# Altium project SLT_110.PrjPcb (part 2 of 3)

## Sheet CAN_I2C.SchDoc
size 420 x 297 mm; SheetNumber: 11; SheetTotal: 20
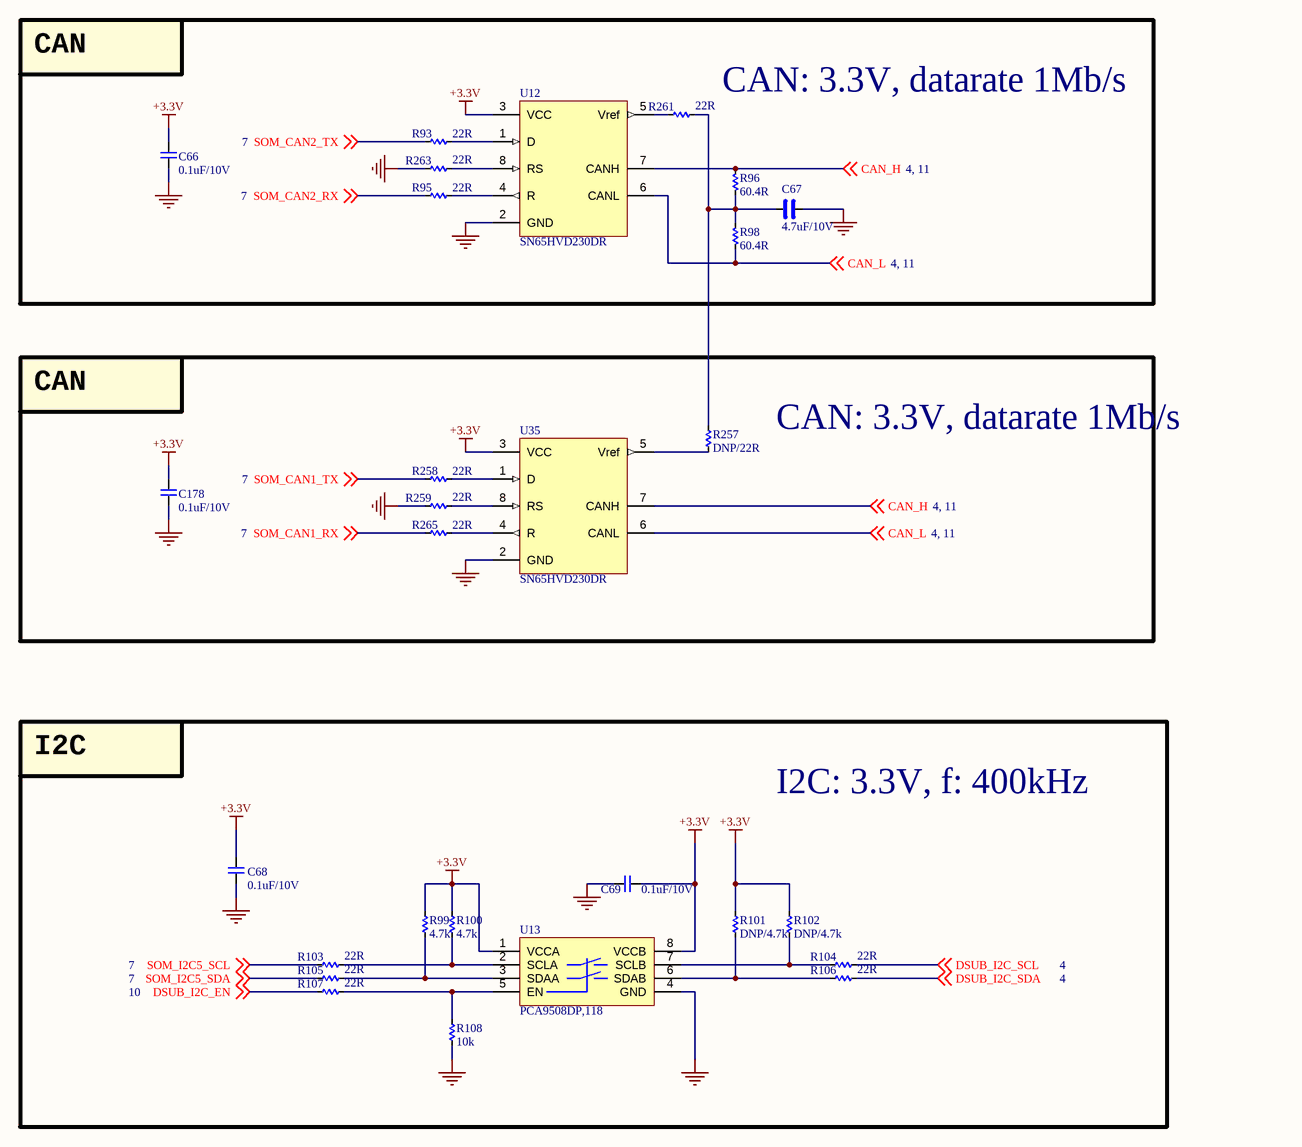
[diagram p9: CAN_I2C.SchDoc]

### Parts
C66  0.1uF/10V  [CAP_C_1005X60]
C67  4.7uF/10V  [CAP_C_1608X80]
C68  0.1uF/10V  [CAP_C_1005X60]
C69  0.1uF/10V  [CAP_C_1005X60]
C178  0.1uF/10V  [CAP_C_1005X60]
R93  22R  [RES_C_1005X40]
R95  22R  [RES_C_1005X40]
R96  60.4R  [RES_C_1005X40]
R98  60.4R  [RES_C_1005X40]
R99  4.7k  [RES_C_1005X40]
R100  4.7k  [RES_C_1005X40]
R101  DNP/4.7k  [RES_C_1005X40]
R102  DNP/4.7k  [RES_C_1005X40]
R103  22R  [RES_C_1005X40]
R104  22R  [RES_C_1005X40]
R105  22R  [RES_C_1005X40]
R106  22R  [RES_C_1005X40]
R107  22R  [RES_C_1005X40]
R108  10k  [RES_C_1005X40]
R257  DNP/22R  [RES_C_1005X40]
R258  22R  [RES_C_1005X40]
R259  22R  [RES_C_1005X40]
R261  22R  [RES_C_1005X40]
R263  22R  [RES_C_1005X40]
R265  22R  [RES_C_1005X40]
U12  SN65HVD230DR  [SOIC127P602X173-8N]
U13  PCA9508DP,118  [TSOP8]
U35  SN65HVD230DR  [SOIC127P602X173-8N]

### Blocks framed on the sheet
CAN: 3.3V, datarate 1Mb/s: C66 C67 R93 R95 R96 R98 R261 R263 U12
CAN: 3.3V, datarate 1Mb/s: C178 R257-R259 R265 U35
I2C: 3.3V, f: 400kHz: C68 C69 R99-R108 U13

### Nets
+3.3V: C66.2 C68.2 C69.1 C178.2 R99.1 R100.1 R101.1 R102.1 U12.3(VCC) U13.1(VCCA) U13.8(VCCB) U35.3(VCC)
GND: C66.1 C67.1 C68.1 C69.2 C178.1 R108.1 R259.2 R263.2 U12.2(GND) U13.4(GND) U35.2(GND)
CAN_H: R96.2 U12.7(CANH) U35.7(CANH) ; off-sheet CAN_H
CAN_L: R98.1 U12.6(CANL) U35.6(CANL) ; off-sheet CAN_L
DSUB_I2C_EN: R107.2 ; off-sheet DSUB_I2C_EN
DSUB_I2C_SCL: R104.1 ; off-sheet DSUB_I2C_SCL
DSUB_I2C_SDA: R106.1 ; off-sheet DSUB_I2C_SDA
SOM_CAN1_RX: R265.1 ; off-sheet SOM_CAN1_RX
SOM_CAN1_TX: R258.1 ; off-sheet SOM_CAN1_TX
SOM_CAN2_RX: R95.1 ; off-sheet SOM_CAN2_RX
SOM_CAN2_TX: R93.1 ; off-sheet SOM_CAN2_TX
SOM_I2C5_SCL: R103.2 ; off-sheet SOM_I2C5_SCL
SOM_I2C5_SDA: R105.2 ; off-sheet SOM_I2C5_SDA
NetC67_2: C67.2 R96.1 R98.2 R257.1 R261.1
NetR93_2: R93.2 U12.1(D)
NetR95_2: R95.2 U12.4(R)
NetR99_2: R99.2 R105.1 U13.3(SDAA)
NetR100_2: R100.2 R103.1 U13.2(SCLA)
NetR101_2: R101.2 R106.2 U13.6(SDAB)
NetR102_2: R102.2 R104.2 U13.7(SCLB)
NetR107_1: R107.1 R108.2 U13.5(EN)
NetR257_2: R257.2 U35.5(Vref)
NetR258_2: R258.2 U35.1(D)
NetR259_1: R259.1 U35.8(RS)
NetR261_2: R261.2 U12.5(Vref)
NetR263_1: R263.1 U12.8(RS)
NetR265_2: R265.2 U35.4(R)

### Notes on the sheet
- CAN
- I2C
- Project:
- Sub-system:
- Design by:
- Sheet title:
- Sheet
- of
- Checked by:
- Approved by:
- Revision:
- Document No:
- Size:
- Date:
- A3

### Library data of the parts
C66 C68 C69 C178 = _CAP_C_2: CAP CHIP
C67 = _CAP_C_High_2: CAP CHIP High Value
R93 R95 R96 R98-R108 R257-R259 R261 R263 R265 = _RES_B_2: RES
U12 U35 = IC_CAN_SN65HVD230DR: IC TRANSCEIVER HALF 1/1 8SOIC

## Sheet USB.SchDoc
size 420 x 297 mm; SheetNumber: 12; SheetTotal: 21
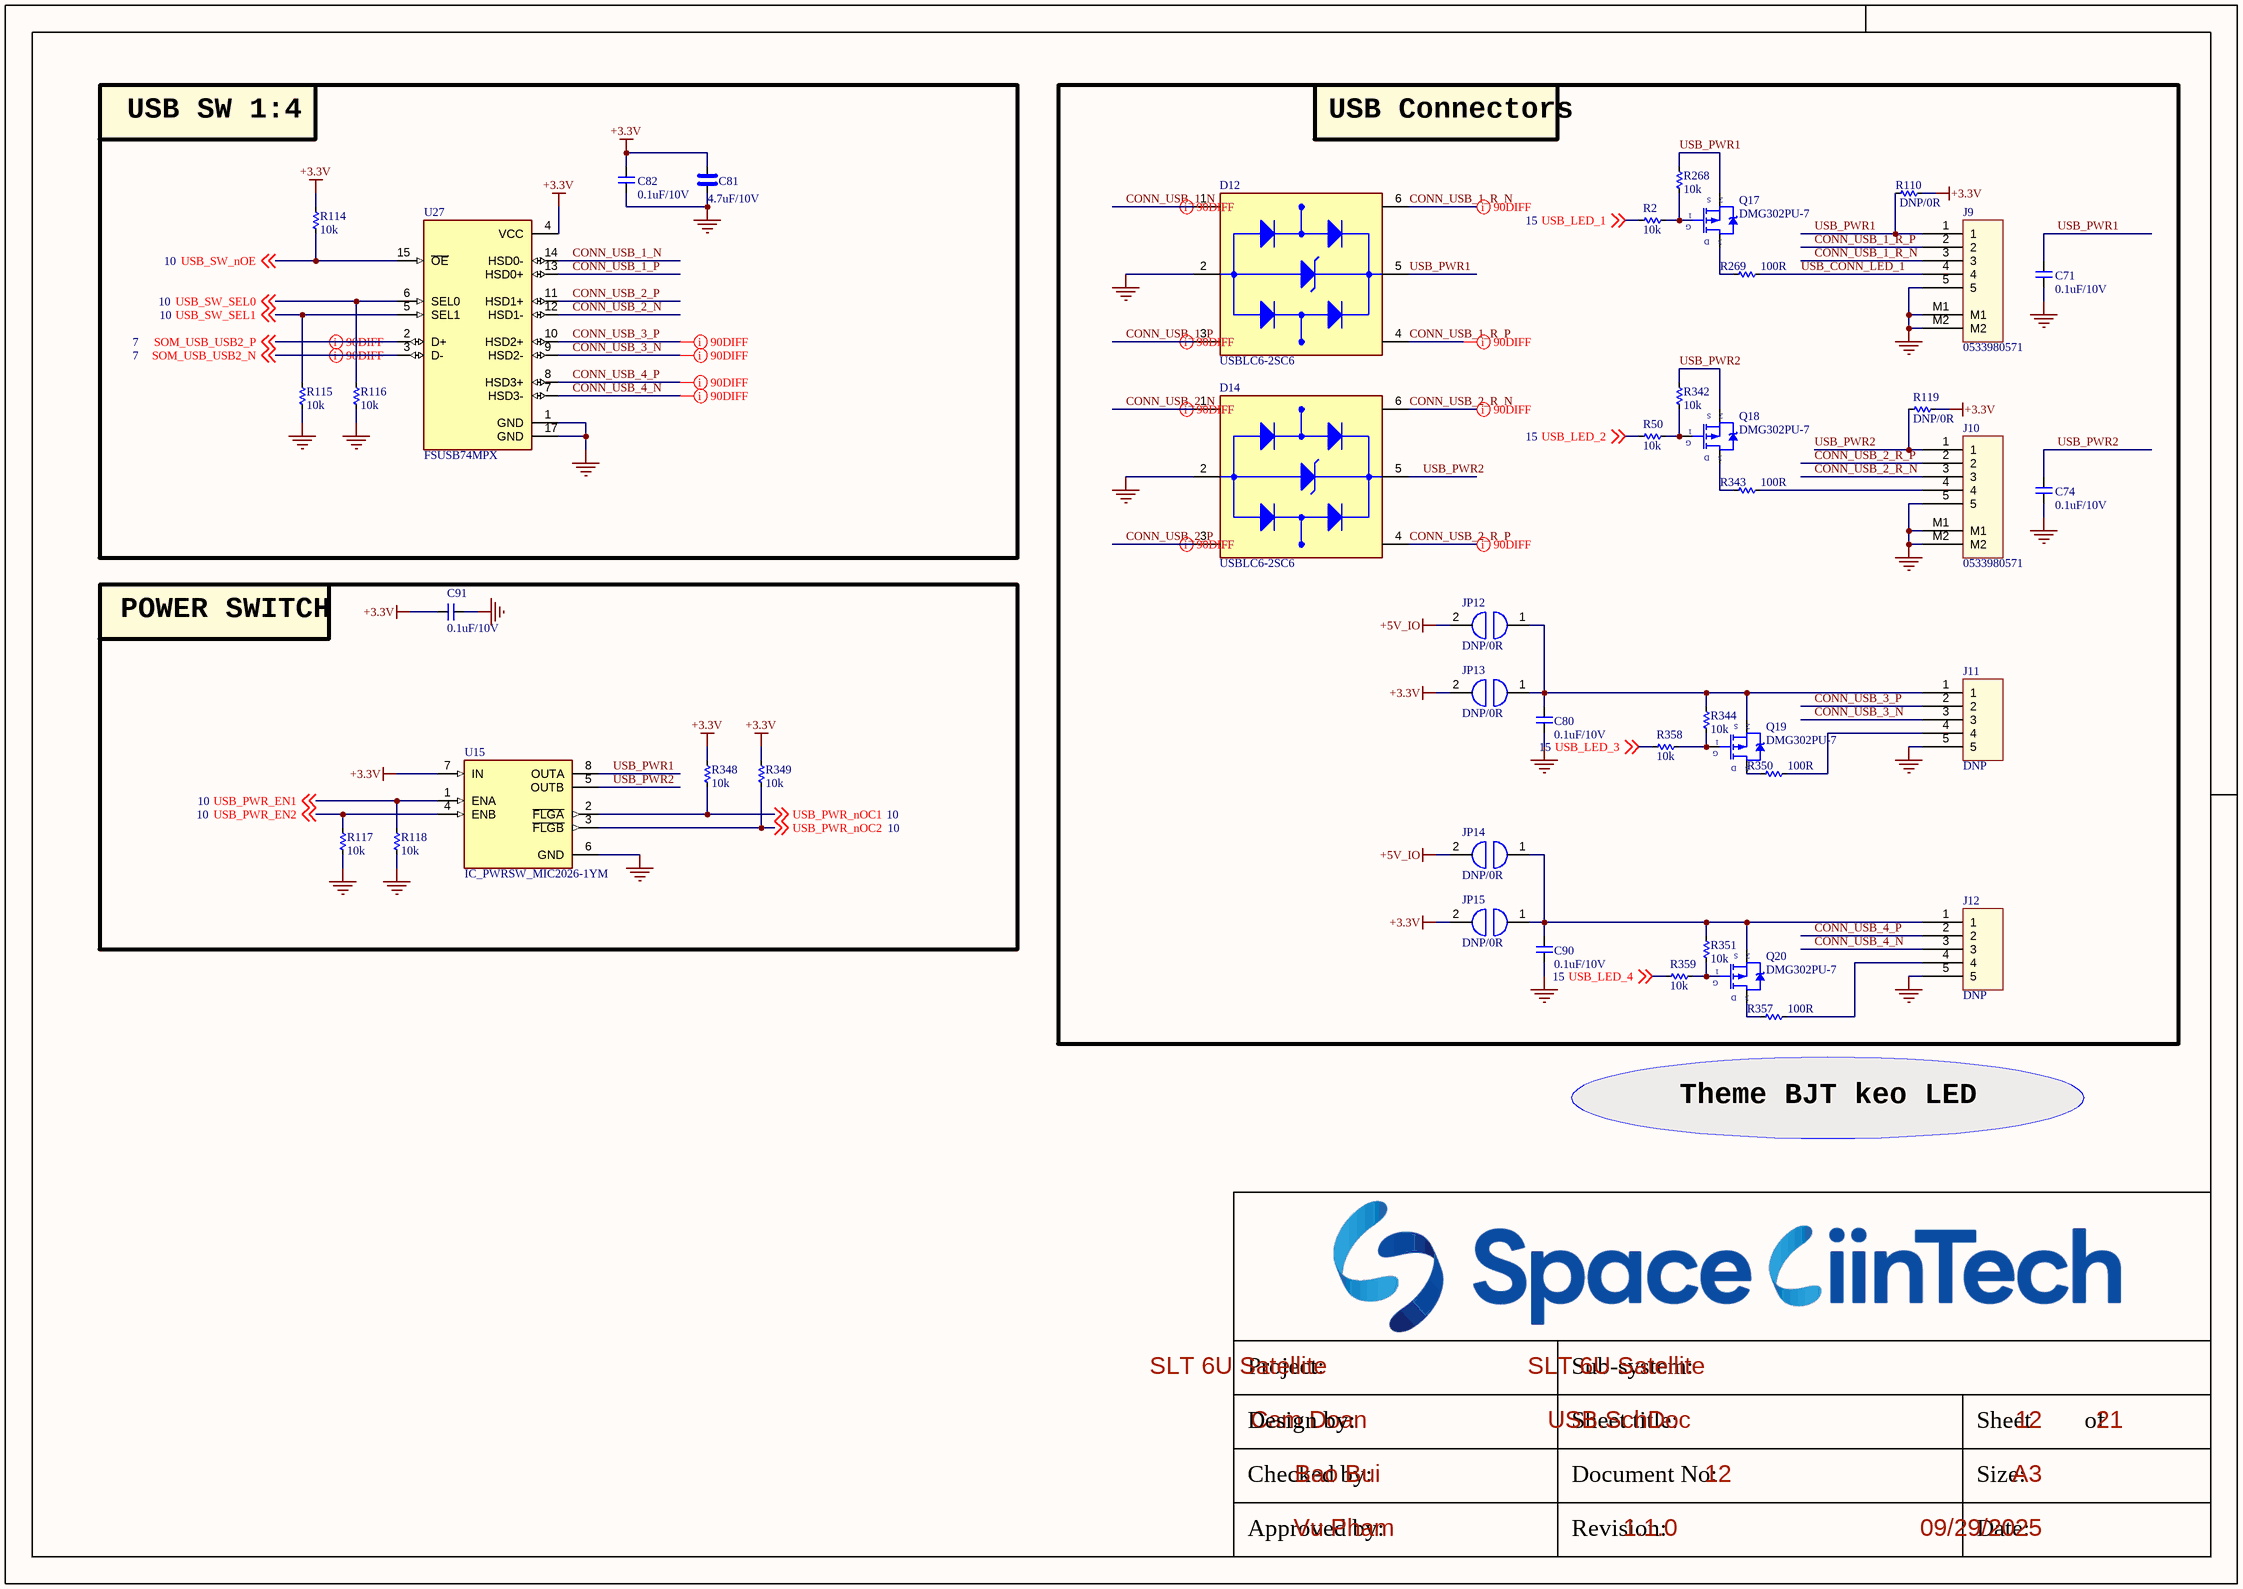
[diagram p10: USB.SchDoc]

### Parts
C71  0.1uF/10V  [CAP_C_1005X60]
C74  0.1uF/10V  [CAP_C_1005X60]
C80  0.1uF/10V  [CAP_C_1005X60]
C81  4.7uF/10V  [CAP_C_1608X80]
C82  0.1uF/10V  [CAP_C_1005X60]
C90  0.1uF/10V  [CAP_C_1005X60]
C91  0.1uF/10V  [CAP_C_1005X60]
D12  USBLC6-2SC6  [SOT95P280X145-6N]
D14  USBLC6-2SC6  [SOT95P280X145-6N]
J9  0533980571  [MOLEX_0533980571]
J10  0533980571  [MOLEX_0533980571]
J11  DNP  [SMD_5_PIN]
J12  DNP  [SMD_5_PIN]
JP12  DNP/0R  [RES_C_1608X60]
JP13  DNP/0R  [RES_C_1608X60]
JP14  DNP/0R  [RES_C_1608X60]
JP15  DNP/0R  [RES_C_1608X60]
Q17  DMG302PU-7  [SOT95P240X120-3N]
Q18  DMG302PU-7  [SOT95P240X120-3N]
Q19  DMG302PU-7  [SOT95P240X120-3N]
Q20  DMG302PU-7  [SOT95P240X120-3N]
R2  10k  [RES_C_1005X40]
R50  10k  [RES_C_1005X40]
R110  DNP/0R  [RES_C_1005X40]
R114  10k  [RES_C_1005X40]
R115  10k  [RES_C_1005X40]
R116  10k  [RES_C_1005X40]
R117  10k  [RES_C_1005X40]
R118  10k  [RES_C_1005X40]
R119  DNP/0R  [RES_C_1005X40]
R268  10k  [RES_C_1005X40]
R269  100R  [RES_C_1005X40]
R342  10k  [RES_C_1005X40]
R343  100R  [RES_C_1005X40]
R344  10k  [RES_C_1005X40]
R348  10k  [RES_C_1005X40]
R349  10k  [RES_C_1005X40]
R350  100R  [RES_C_1005X40]
R351  10k  [RES_C_1005X40]
R357  100R  [RES_C_1005X40]
R358  10k  [RES_C_1005X40]
R359  10k  [RES_C_1005X40]
U15  IC_PWRSW_MIC2026-1YM  [SOIC127P602X173-8N]
U27  FSUSB74MPX  [QFN50P300X300X80-17N]

### Blocks framed on the sheet
USB SW 1:4: C81 C82 R114-R116 U27
USB Connectors: C71 C74 C80 C90 D12 D14 J9-J12 JP12-JP15 Q17-Q20 R2 R50 R110 R119 R268 R269 R342-R344 R350 R351 R357-R359
POWER SWITCH: C91 R117 R118 R348 R349 U15

### Nets
+3.3V: C81.2 C82.2 C91.2 JP13.2 JP15.2 R110.1 R114.1 R119.1 R348.1 R349.1 U15.7(IN) U27.4(VCC)
+5V_IO: JP12.2 JP14.2  [project net NTC1+]
GND: C71.1 C74.1 C80.1 C81.1 C82.1 C90.1 C91.1 D12.2(GND) D14.2(GND) J9.5 J9.M1 J9.M2 J10.5 J10.M1 J10.M2 J11.5 J12.5 R115.2 R116.2 R117.2 R118.2 U15.6(GND) U27.1(GND) U27.17(GND)
CONN_USB_1_N: D12.1(I/O1_IN) U27.14(HSD0-)
CONN_USB_1_P: D12.3(I/O2_IN) U27.13(HSD0+)
CONN_USB_1_R_N: D12.6(I/O1_OUT) J9.3
CONN_USB_1_R_P: D12.4(I/O2_OUT) J9.2
CONN_USB_2_N: D14.1(I/O1_IN) U27.12(HSD1-)
CONN_USB_2_P: D14.3(I/O2_IN) U27.11(HSD1+)
CONN_USB_2_R_N: D14.6(I/O1_OUT) J10.3
CONN_USB_2_R_P: D14.4(I/O2_OUT) J10.2
CONN_USB_3_N: J11.3 U27.9(HSD2-)
CONN_USB_3_P: J11.2 U27.10(HSD2+)
CONN_USB_4_N: J12.3 U27.7(HSD3-)
CONN_USB_4_P: J12.2 U27.8(HSD3+)
SOM_USB_USB2_N: U27.3(D-) ; off-sheet SOM_USB_USB2_N
SOM_USB_USB2_P: U27.2(D+) ; off-sheet SOM_USB_USB2_P
USB_CONN_LED_1: J9.4 R269.2
USB_LED_1: R2.1 ; off-sheet USB_LED_1
USB_LED_2: R50.1 ; off-sheet USB_LED_2
USB_LED_3: R358.1 ; off-sheet USB_LED_3
USB_LED_4: R359.1 ; off-sheet USB_LED_4
USB_PWR1: C71.2 D12.5(VBUS) J9.1 Q17.2(S) R110.2 R268.1 U15.8(OUTA)
USB_PWR2: C74.2 D14.5(VBUS) J10.1 Q18.2(S) R119.2 R342.1 U15.5(OUTB)
USB_PWR_EN1: R118.1 U15.1(ENA) ; off-sheet USB_PWR_EN1
USB_PWR_EN2: R117.1 U15.4(ENB) ; off-sheet USB_PWR_EN2
USB_PWR_nOC1: R348.2 U15.2(~{FLGA}) ; off-sheet USB_PWR_nOC1
USB_PWR_nOC2: R349.2 U15.3(~{FLGB}) ; off-sheet USB_PWR_nOC2
USB_SW_nOE: R114.2 U27.15(~{OE}) ; off-sheet USB_SW_nOE
USB_SW_SEL0: R116.1 U27.6(SEL0) ; off-sheet USB_SW_SEL0
USB_SW_SEL1: R115.1 U27.5(SEL1) ; off-sheet USB_SW_SEL1
NetC80_2: C80.2 J11.1 JP12.1 JP13.1 Q19.2(S) R344.1
NetC90_2: C90.2 J12.1 JP14.1 JP15.1 Q20.2(S) R351.1
NetJ10_4: J10.4 R343.2
NetJ11_4: J11.4 R350.2
NetJ12_4: J12.4 R357.2
NetQ17_1: Q17.1(G) R2.2 R268.2
NetQ17_3: Q17.3(D) R269.1
NetQ18_1: Q18.1(G) R50.2 R342.2
NetQ18_3: Q18.3(D) R343.1
NetQ19_1: Q19.1(G) R344.2 R358.2
NetQ19_3: Q19.3(D) R350.1
NetQ20_1: Q20.1(G) R351.2 R359.2
NetQ20_3: Q20.3(D) R357.1

### Layout directives
differential pair; differential pair class DIFF90: CONN_USB_1_N, CONN_USB_1_P, CONN_USB_1_R_N, CONN_USB_1_R_P, CONN_USB_2_N, CONN_USB_2_P, CONN_USB_2_R_N, CONN_USB_2_R_P, CONN_USB_3_N, CONN_USB_3_P, CONN_USB_4_N, CONN_USB_4_P, SOM_USB_USB2_N, SOM_USB_USB2_P

### Notes on the sheet
- Theme BJT keo LED
- Project:
- Sub-system:
- Design by:
- Sheet title:
- Sheet
- of
- Checked by:
- Approved by:
- Revision:
- Document No:
- Size:
- Date:
- A3

### Library data of the parts
C71 C74 C80 C82 C90 C91 = _CAP_C_2: CAP CHIP
C81 = _CAP_C_High_2: CAP CHIP High Value
D12 D14 = USBLC6-2SC6: 17V Clamp 5A (8/20Âµs) Ipp Tvs Diode Surface Mount SOT-23-6; MF: STMicroelectronics; Value: *; SnapEDA_Link: https://www.snapeda.com/parts/USBLC6-2SC6/STMicroelectronics/view-part/?ref=snap; Check_prices: https://www.snapeda.com/parts/USBLC6-2SC6/STMicroelectronics/view-part/?ref=eda; Purchase-URL: https://pricing.snapeda.com/search/part/USBLC6-2SC6/?ref=eda; Price: None; Availability: In Stock; Package: SOT-23-6 STMicroelectronics; MP: USBLC6-2SC6
J9 J10 = Header 5x1_2M
J11 J12 = Header 5x1
JP12-JP15 = JUMPER
Q17-Q20 = MOSFET_P_GSD
R2 R50 R110 R114-R119 R268 R269 R342-R344 R348-R351 R357-R359 = _RES_B_2: RES
U15 = IC_PWRSW_MIC2026-1YM: Power Switch/Driver 1:2 N-Channel 1.25A 8-SOIC; MF: Microchip; SnapEDA_Link: https://www.snapeda.com/parts/MIC2026-1YM/Microchip/view-part/?ref=snap; Package: SO-8 Microchip; Value: *; MP: MIC2026-1YM; Check_prices: https://www.snapeda.com/parts/MIC2026-1YM/Microchip/view-part/?ref=eda
U27 = IC_USB_SW_FSUSB74MPX: USB Switch IC 1 Channel 16-MLP (3x3); MF: ON Semiconductor; SnapEDA_Link: https://www.snapeda.com/parts/FSUSB74MPX/Onsemi/view-part/?ref=snap; Package: WQFN-16 ON Semiconductor; Value: *; MP: FSUSB74MPX; Check_prices: https://www.snapeda.com/parts/FSUSB74MPX/Onsemi/view-part/?ref=eda

## Sheet LED.SchDoc
size 420 x 297 mm; SheetNumber: 13; SheetTotal: 21
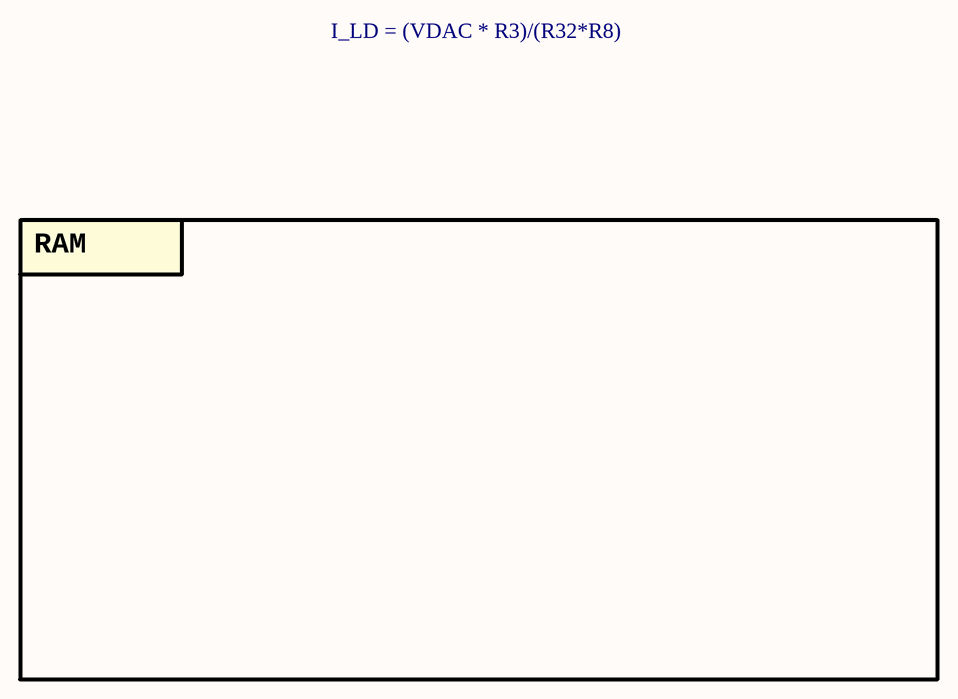
[diagram p11: LED.SchDoc]

### Notes on the sheet
- I_LD = (VDAC * R3)/(R32*R8)
- RAM
- Project:
- Sub-system:
- Design by:
- Sheet title:
- Sheet
- of
- Checked by:
- Approved by:
- Revision:
- Document No:
- Size:
- Date:
- A3

## Sheet TEC.SchDoc
size 420 x 297 mm; SheetNumber: 14; SheetTotal: 19
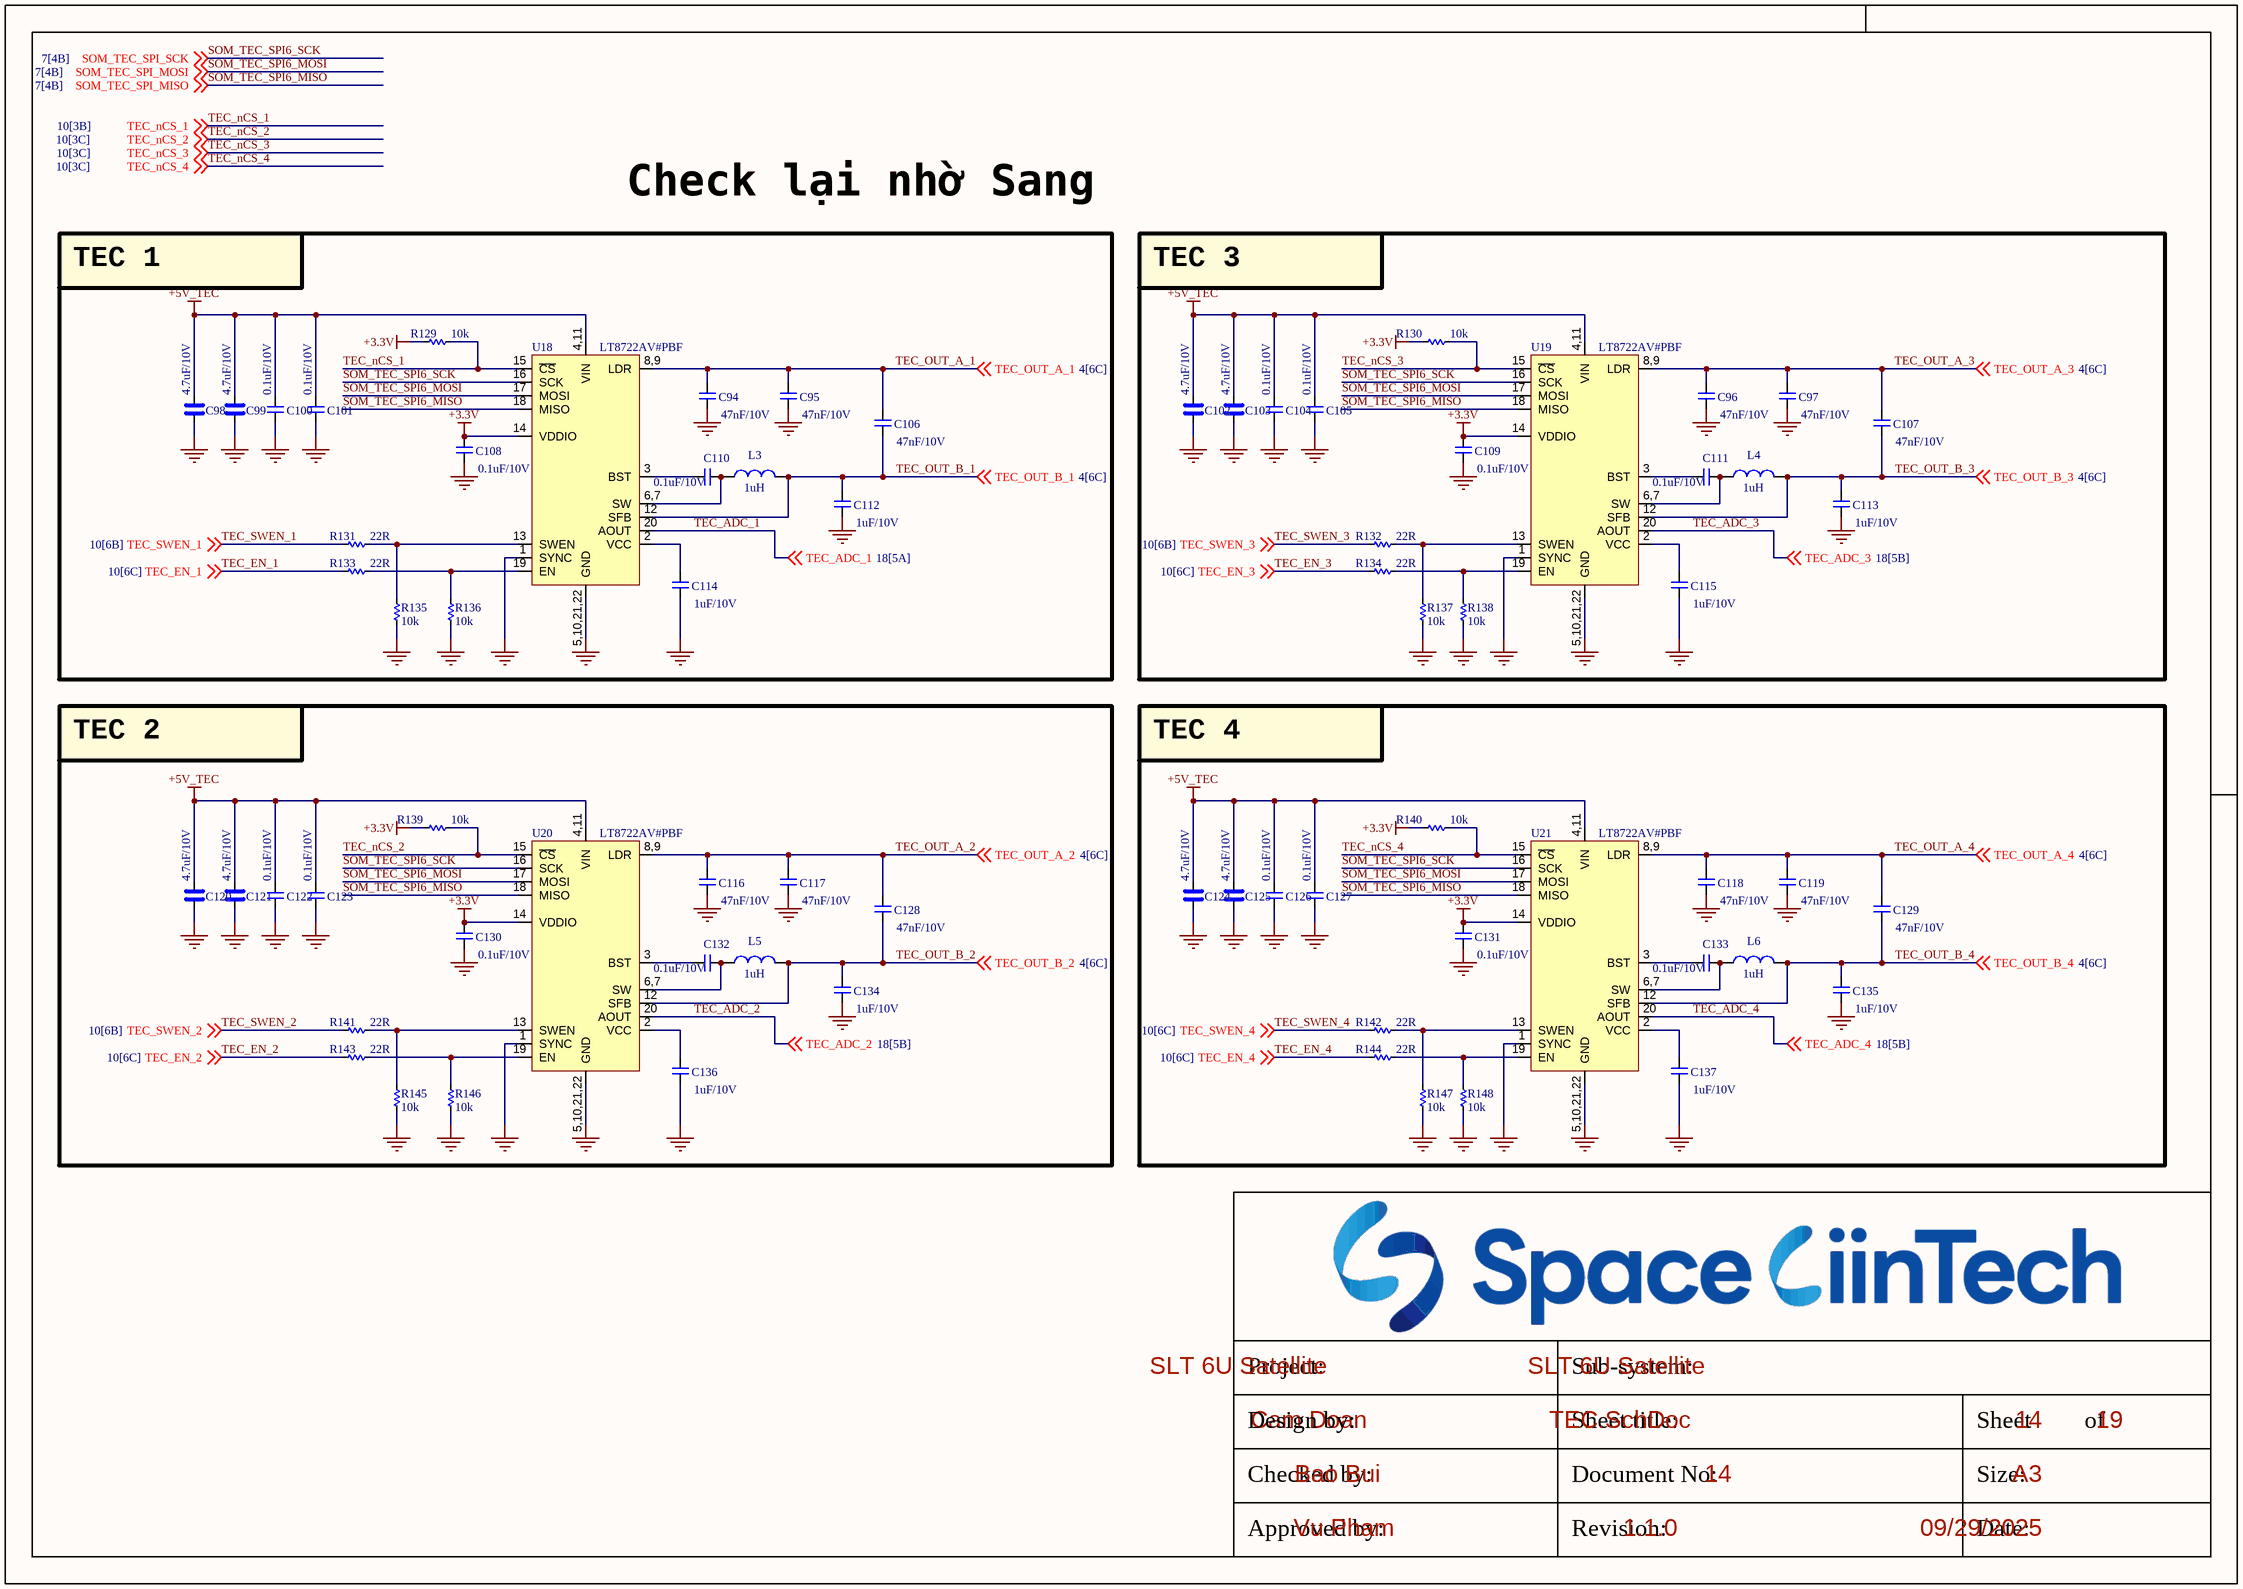
[diagram p12: TEC.SchDoc]

### Parts
C94  47nF/10V  [CAP_C_1005X60]
C95  47nF/10V  [CAP_C_1005X60]
C96  47nF/10V  [CAP_C_1005X60]
C97  47nF/10V  [CAP_C_1005X60]
C98  4.7uF/10V  [CAP_C_1608X80]
C99  4.7uF/10V  [CAP_C_1608X80]
C100  0.1uF/10V  [CAP_C_1005X60]
C101  0.1uF/10V  [CAP_C_1005X60]
C102  4.7uF/10V  [CAP_C_1608X80]
C103  4.7uF/10V  [CAP_C_1608X80]
C104  0.1uF/10V  [CAP_C_1005X60]
C105  0.1uF/10V  [CAP_C_1005X60]
C106  47nF/10V  [CAP_C_1005X60]
C107  47nF/10V  [CAP_C_1005X60]
C108  0.1uF/10V  [CAP_C_1005X60]
C109  0.1uF/10V  [CAP_C_1005X60]
C110  0.1uF/10V  [CAP_C_1005X60]
C111  0.1uF/10V  [CAP_C_1005X60]
C112  1uF/10V  [CAP_C_1005X60]
C113  1uF/10V  [CAP_C_1005X60]
C114  1uF/10V  [CAP_C_1005X60]
C115  1uF/10V  [CAP_C_1005X60]
C116  47nF/10V  [CAP_C_1005X60]
C117  47nF/10V  [CAP_C_1005X60]
C118  47nF/10V  [CAP_C_1005X60]
C119  47nF/10V  [CAP_C_1005X60]
C120  4.7uF/10V  [CAP_C_1608X80]
C121  4.7uF/10V  [CAP_C_1608X80]
C122  0.1uF/10V  [CAP_C_1005X60]
C123  0.1uF/10V  [CAP_C_1005X60]
C124  4.7uF/10V  [CAP_C_1608X80]
C125  4.7uF/10V  [CAP_C_1608X80]
C126  0.1uF/10V  [CAP_C_1005X60]
C127  0.1uF/10V  [CAP_C_1005X60]
C128  47nF/10V  [CAP_C_1005X60]
C129  47nF/10V  [CAP_C_1005X60]
C130  0.1uF/10V  [CAP_C_1005X60]
C131  0.1uF/10V  [CAP_C_1005X60]
C132  0.1uF/10V  [CAP_C_1005X60]
C133  0.1uF/10V  [CAP_C_1005X60]
C134  1uF/10V  [CAP_C_1005X60]
C135  1uF/10V  [CAP_C_1005X60]
C136  1uF/10V  [CAP_C_1005X60]
C137  1uF/10V  [CAP_C_1005X60]
L3  1uH  [L-SMD-M-3.5x3.5x2mm]
L4  1uH  [L-SMD-M-3.5x3.5x2mm]
L5  1uH  [L-SMD-M-3.5x3.5x2mm]
L6  1uH  [L-SMD-M-3.5x3.5x2mm]
R129  10k  [RES_C_1005X40]
R130  10k  [RES_C_1005X40]
R131  22R  [RES_C_1005X40]
R132  22R  [RES_C_1005X40]
R133  22R  [RES_C_1005X40]
R134  22R  [RES_C_1005X40]
R135  10k  [RES_C_1005X40]
R136  10k  [RES_C_1005X40]
R137  10k  [RES_C_1005X40]
R138  10k  [RES_C_1005X40]
R139  10k  [RES_C_1005X40]
R140  10k  [RES_C_1005X40]
R141  22R  [RES_C_1005X40]
R142  22R  [RES_C_1005X40]
R143  22R  [RES_C_1005X40]
R144  22R  [RES_C_1005X40]
R145  10k  [RES_C_1005X40]
R146  10k  [RES_C_1005X40]
R147  10k  [RES_C_1005X40]
R148  10k  [RES_C_1005X40]
U18  LT8722AV#PBF  [QFN18]
U19  LT8722AV#PBF  [QFN18]
U20  LT8722AV#PBF  [QFN18]
U21  LT8722AV#PBF  [QFN18]

### Blocks framed on the sheet
TEC 1: C94 C95 C98-C101 C106 C108 C110 C112 C114 L3 R129 R131 R133 R135 R136 U18
TEC 3: C96 C97 C102-C105 C107 C109 C111 C113 C115 L4 R130 R132 R134 R137 R138 U19
TEC 2: C116 C117 C120-C123 C128 C130 C132 C134 C136 L5 R139 R141 R143 R145 R146 U20
TEC 4: C118 C119 C124-C127 C129 C131 C133 C135 C137 L6 R140 R142 R144 R147 R148 U21

### Nets
+3.3V: C108.2 C109.2 C130.2 C131.2 R129.1 R130.1 R139.1 R140.1 U18.14(VDDIO) U19.14(VDDIO) U20.14(VDDIO) U21.14(VDDIO)
+5V_TEC: C98.2 C99.2 C100.2 C101.2 C102.2 C103.2 C104.2 C105.2 C120.2 C121.2 C122.2 C123.2 C124.2 C125.2 C126.2 C127.2 U18.4,11(VIN) U19.4,11(VIN) U20.4,11(VIN) U21.4,11(VIN)
GND: C94.1 C95.1 C96.1 C97.1 C98.1 C99.1 C100.1 C101.1 C102.1 C103.1 C104.1 C105.1 C108.1 C109.1 C112.1 C113.1 C114.1 C115.1 C116.1 C117.1 C118.1 C119.1 C120.1 C121.1 C122.1 C123.1 C124.1 C125.1 C126.1 C127.1 C130.1 C131.1 C134.1 C135.1 C136.1 C137.1 R135.2 R136.2 R137.2 R138.2 R145.2 R146.2 R147.2 R148.2 U18.1(SYNC) U18.5,10,21,22(GND) U19.1(SYNC) U19.5,10,21,22(GND) U20.1(SYNC) U20.5,10,21,22(GND) U21.1(SYNC) U21.5,10,21,22(GND)
SOM_TEC_SPI6_MISO: U18.18(MISO) U19.18(MISO) U20.18(MISO) U21.18(MISO) ; off-sheet SOM_TEC_SPI_MISO  [also labelled SOM_TEC_SPI_MISO]
SOM_TEC_SPI6_MOSI: U18.17(MOSI) U19.17(MOSI) U20.17(MOSI) U21.17(MOSI) ; off-sheet SOM_TEC_SPI_MOSI  [also labelled SOM_TEC_SPI_MOSI]
SOM_TEC_SPI6_SCK: U18.16(SCK) U19.16(SCK) U20.16(SCK) U21.16(SCK) ; off-sheet SOM_TEC_SPI_SCK  [also labelled SOM_TEC_SPI_SCK]
TEC_ADC_1: U18.20(AOUT) ; off-sheet TEC_ADC_1
TEC_ADC_2: U20.20(AOUT) ; off-sheet TEC_ADC_2
TEC_ADC_3: U19.20(AOUT) ; off-sheet TEC_ADC_3
TEC_ADC_4: U21.20(AOUT) ; off-sheet TEC_ADC_4
TEC_EN_1: R133.2 ; off-sheet TEC_EN_1
TEC_EN_2: R143.2 ; off-sheet TEC_EN_2
TEC_EN_3: R134.2 ; off-sheet TEC_EN_3
TEC_EN_4: R144.2 ; off-sheet TEC_EN_4
TEC_nCS_1: R129.2 U18.15(~{CS}) ; off-sheet TEC_nCS_1
TEC_nCS_2: R139.2 U20.15(~{CS}) ; off-sheet TEC_nCS_2
TEC_nCS_3: R130.2 U19.15(~{CS}) ; off-sheet TEC_nCS_3
TEC_nCS_4: R140.2 U21.15(~{CS}) ; off-sheet TEC_nCS_4
TEC_OUT_A_1: C94.2 C95.2 C106.2 U18.8,9(LDR) ; off-sheet TEC_OUT_A_1
TEC_OUT_A_2: C116.2 C117.2 C128.2 U20.8,9(LDR) ; off-sheet TEC_OUT_A_2
TEC_OUT_A_3: C96.2 C97.2 C107.2 U19.8,9(LDR) ; off-sheet TEC_OUT_A_3
TEC_OUT_A_4: C118.2 C119.2 C129.2 U21.8,9(LDR) ; off-sheet TEC_OUT_A_4
TEC_OUT_B_1: C106.1 C112.2 L3.2 U18.12(SFB) ; off-sheet TEC_OUT_B_1
TEC_OUT_B_2: C128.1 C134.2 L5.2 U20.12(SFB) ; off-sheet TEC_OUT_B_2
TEC_OUT_B_3: C107.1 C113.2 L4.2 U19.12(SFB) ; off-sheet TEC_OUT_B_3
TEC_OUT_B_4: C129.1 C135.2 L6.2 U21.12(SFB) ; off-sheet TEC_OUT_B_4
TEC_SWEN_1: R131.1 ; off-sheet TEC_SWEN_1
TEC_SWEN_2: R141.1 ; off-sheet TEC_SWEN_2
TEC_SWEN_3: R132.1 ; off-sheet TEC_SWEN_3
TEC_SWEN_4: R142.1 ; off-sheet TEC_SWEN_4
NetC110_1: C110.1 L3.1 U18.6,7(SW)
NetC110_2: C110.2 U18.3(BST)
NetC111_1: C111.1 L4.1 U19.6,7(SW)
NetC111_2: C111.2 U19.3(BST)
NetC114_2: C114.2 U18.2(VCC)
NetC115_2: C115.2 U19.2(VCC)
NetC132_1: C132.1 L5.1 U20.6,7(SW)
NetC132_2: C132.2 U20.3(BST)
NetC133_1: C133.1 L6.1 U21.6,7(SW)
NetC133_2: C133.2 U21.3(BST)
NetC136_2: C136.2 U20.2(VCC)
NetC137_2: C137.2 U21.2(VCC)
NetR131_2: R131.2 R135.1 U18.13(SWEN)
NetR132_2: R132.2 R137.1 U19.13(SWEN)
NetR133_1: R133.1 R136.1 U18.19(EN)
NetR134_1: R134.1 R138.1 U19.19(EN)
NetR141_2: R141.2 R145.1 U20.13(SWEN)
NetR142_2: R142.2 R147.1 U21.13(SWEN)
NetR143_1: R143.1 R146.1 U20.19(EN)
NetR144_1: R144.1 R148.1 U21.19(EN)

### Notes on the sheet
- Check lại nhờ Sang
- Project:
- Sub-system:
- Design by:
- Sheet title:
- Sheet
- of
- Checked by:
- Approved by:
- Revision:
- Document No:
- Size:
- Date:
- A3

### Library data of the parts
C94-C97 C100 C101 C104-C119 C122 C123 C126-C137 = _CAP_C_2: CAP CHIP
C98 C99 C102 C103 C120 C121 C124 C125 = _CAP_C_High_2: CAP CHIP High Value
L3-L6 = L-SMD-1: partNo: 78477010; Manufacturer: Wurth Elektronik; Inductance: 1.0 μH; ComponentLink1Description: Manufacturer; ComponentLink1URL: http://www.we-online.de; Created by: Baojun Chen; Created Date: Nov.2015; ComponentLink2Description: Datasheet; ComponentLink2URL: http://katalog.we-online.de/pbs/datasheet/78477010.pdf
R129-R148 = _RES_B_2: RES
U18-U21 = LT8722

## Sheet HEATER.SchDoc
size 420 x 297 mm; SheetNumber: 15; SheetTotal: 21
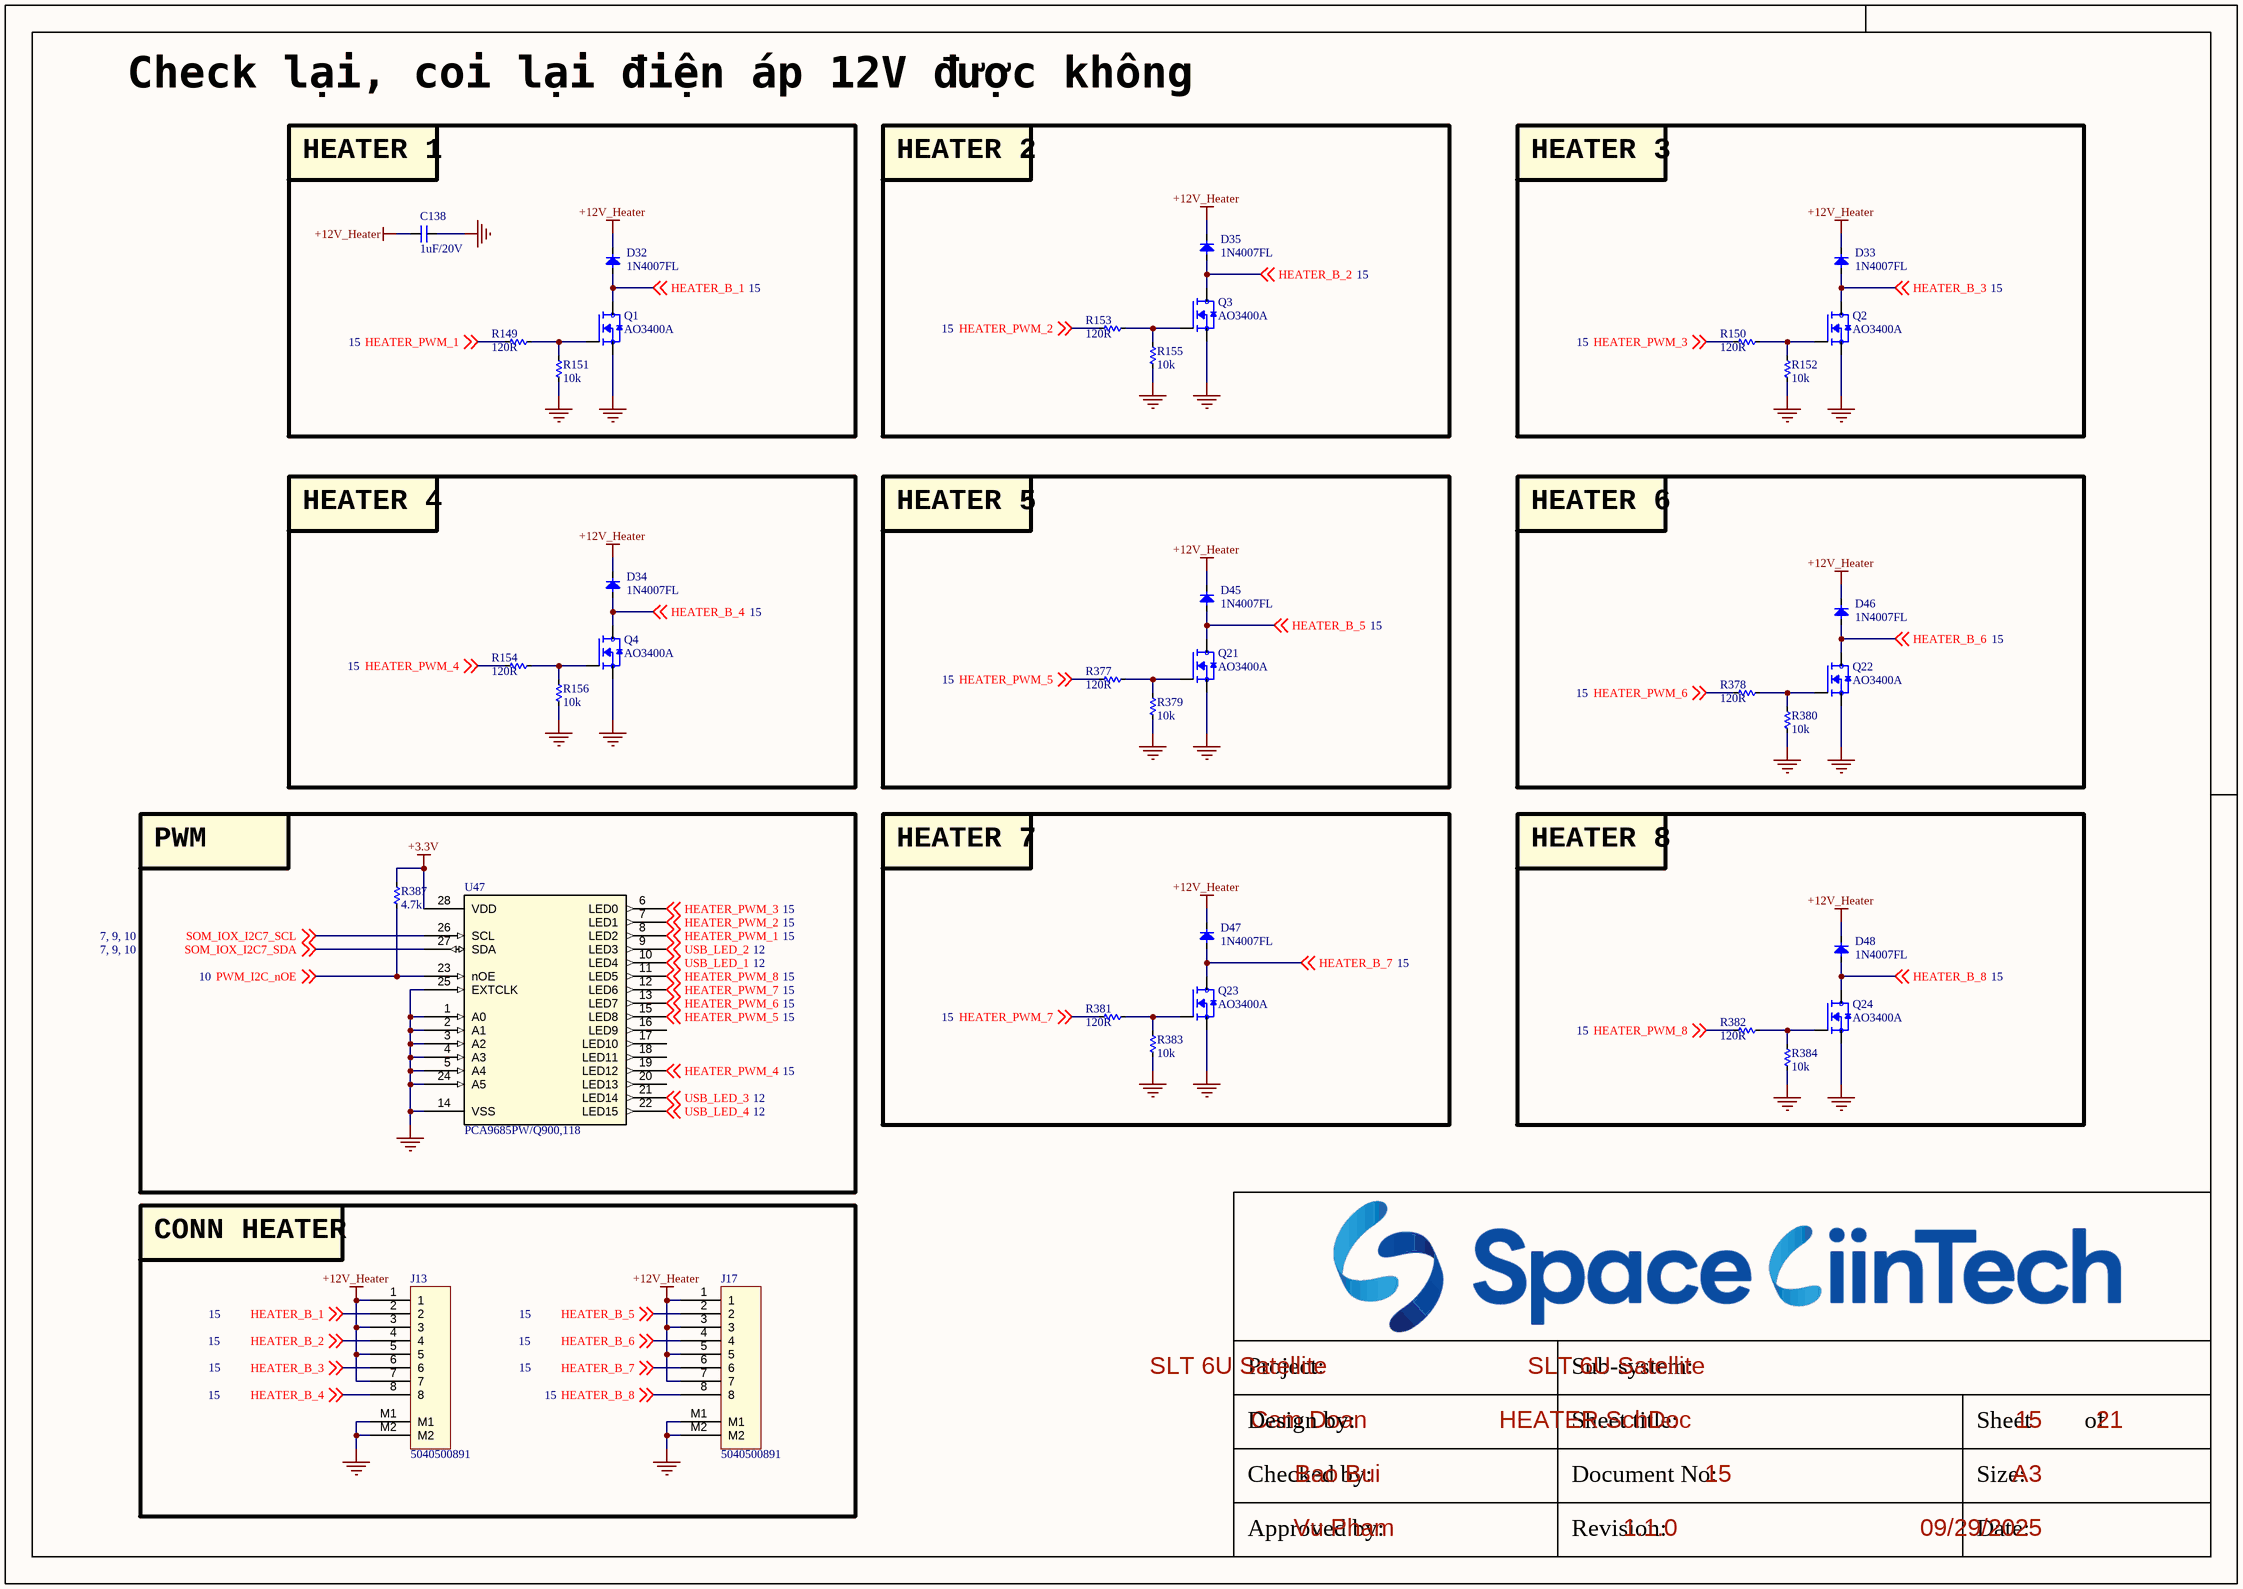
[diagram p13: HEATER.SchDoc]

### Parts
C138  1uF/20V  [CAP_C_1005X60]
D32  1N4007FL  [SOD3717X145N]
D33  1N4007FL  [SOD3717X145N]
D34  1N4007FL  [SOD3717X145N]
D35  1N4007FL  [SOD3717X145N]
D45  1N4007FL  [SOD3717X145N]
D46  1N4007FL  [SOD3717X145N]
D47  1N4007FL  [SOD3717X145N]
D48  1N4007FL  [SOD3717X145N]
J13  5040500891  [MOLEX_5040500891]
J17  5040500891  [MOLEX_5040500891]
Q1  AO3400A  [SOT95P240X120-3N]
Q2  AO3400A  [SOT95P240X120-3N]
Q3  AO3400A  [SOT95P240X120-3N]
Q4  AO3400A  [SOT95P240X120-3N]
Q21  AO3400A  [SOT95P240X120-3N]
Q22  AO3400A  [SOT95P240X120-3N]
Q23  AO3400A  [SOT95P240X120-3N]
Q24  AO3400A  [SOT95P240X120-3N]
R149  120R  [RES_C_1005X40]
R150  120R  [RES_C_1005X40]
R151  10k  [RES_C_1005X40]
R152  10k  [RES_C_1005X40]
R153  120R  [RES_C_1005X40]
R154  120R  [RES_C_1005X40]
R155  10k  [RES_C_1005X40]
R156  10k  [RES_C_1005X40]
R377  120R  [RES_C_1005X40]
R378  120R  [RES_C_1005X40]
R379  10k  [RES_C_1005X40]
R380  10k  [RES_C_1005X40]
R381  120R  [RES_C_1005X40]
R382  120R  [RES_C_1005X40]
R383  10k  [RES_C_1005X40]
R384  10k  [RES_C_1005X40]
R387  4.7k  [RES_C_1005X40]
U47  PCA9685PW/Q900,118  [TSSOP28_SOT361-1_NXP]

### Blocks framed on the sheet
HEATER 1: C138 D32 Q1 R149 R151
HEATER 2: D35 Q3 R153 R155
HEATER 3: D33 Q2 R150 R152
HEATER 4: D34 Q4 R154 R156
HEATER 5: D45 Q21 R377 R379
HEATER 6: D46 Q22 R378 R380
PWM: R387 U47
HEATER 7: D47 Q23 R381 R383
HEATER 8: D48 Q24 R382 R384
CONN HEATER: J13 J17

### Nets
+3.3V: R387.2 U47.28(VDD)
+12V_Heater: C138.2 D32.1(K) D33.1(K) D34.1(K) D35.1(K) D45.1(K) D46.1(K) D47.1(K) D48.1(K) J13.1 J13.3 J13.5 J13.7 J17.1 J17.3 J17.5 J17.7
GND: C138.1 J13.M1 J13.M2 J17.M1 J17.M2 Q1.2(S) Q2.2(S) Q3.2(S) Q4.2(S) Q21.2(S) Q22.2(S) Q23.2(S) Q24.2(S) R151.1 R152.1 R155.1 R156.1 R379.1 R380.1 R383.1 R384.1 U47.1(A0) U47.2(A1) U47.3(A2) U47.4(A3) U47.5(A4) U47.14(VSS) U47.24(A5) U47.25(EXTCLK)
HEATER_B_1: D32.2(A) J13.2 Q1.3(D) ; off-sheet HEATER_B_1
HEATER_B_2: D35.2(A) J13.4 Q3.3(D) ; off-sheet HEATER_B_2
HEATER_B_3: D33.2(A) J13.6 Q2.3(D) ; off-sheet HEATER_B_3
HEATER_B_4: D34.2(A) J13.8 Q4.3(D) ; off-sheet HEATER_B_4
HEATER_B_5: D45.2(A) J17.2 Q21.3(D) ; off-sheet HEATER_B_5
HEATER_B_6: D46.2(A) J17.4 Q22.3(D) ; off-sheet HEATER_B_6
HEATER_B_7: D47.2(A) J17.6 Q23.3(D) ; off-sheet HEATER_B_7
HEATER_B_8: D48.2(A) J17.8 Q24.3(D) ; off-sheet HEATER_B_8
HEATER_PWM_1: R149.1 U47.8(LED2) ; off-sheet HEATER_PWM_1
HEATER_PWM_2: R153.1 U47.7(LED1) ; off-sheet HEATER_PWM_2
HEATER_PWM_3: R150.1 U47.6(LED0) ; off-sheet HEATER_PWM_3
HEATER_PWM_4: R154.1 U47.19(LED12) ; off-sheet HEATER_PWM_4
HEATER_PWM_5: R377.1 U47.15(LED8) ; off-sheet HEATER_PWM_5
HEATER_PWM_6: R378.1 U47.13(LED7) ; off-sheet HEATER_PWM_6
HEATER_PWM_7: R381.1 U47.12(LED6) ; off-sheet HEATER_PWM_7
HEATER_PWM_8: R382.1 U47.11(LED5) ; off-sheet HEATER_PWM_8
PWM_I2C_nOE: R387.1 U47.23(nOE) ; off-sheet PWM_I2C_nOE
SOM_IOX_I2C7_SCL: U47.26(SCL) ; off-sheet SOM_IOX_I2C7_SCL
SOM_IOX_I2C7_SDA: U47.27(SDA) ; off-sheet SOM_IOX_I2C7_SDA
USB_LED_1: U47.10(LED4) ; off-sheet USB_LED_1
USB_LED_2: U47.9(LED3) ; off-sheet USB_LED_2
USB_LED_3: U47.21(LED14) ; off-sheet USB_LED_3
USB_LED_4: U47.22(LED15) ; off-sheet USB_LED_4
NetQ1_1: Q1.1(G) R149.2 R151.2
NetQ2_1: Q2.1(G) R150.2 R152.2
NetQ3_1: Q3.1(G) R153.2 R155.2
NetQ4_1: Q4.1(G) R154.2 R156.2
NetQ21_1: Q21.1(G) R377.2 R379.2
NetQ22_1: Q22.1(G) R378.2 R380.2
NetQ23_1: Q23.1(G) R381.2 R383.2
NetQ24_1: Q24.1(G) R382.2 R384.2

Not connected (* = marked no-connect by the designer): U47 16(LED9) 17(LED10) 18(LED11) 20(LED13)

### Notes on the sheet
- Check lại, coi lại điện áp 12V được không
- Project:
- Sub-system:
- Design by:
- Sheet title:
- Sheet
- of
- Checked by:
- Approved by:
- Revision:
- Document No:
- Size:
- Date:
- A3

### Library data of the parts
C138 = _CAP_C_2: CAP CHIP
D32-D35 D45-D48 = Diode SMD: Default Diode; Code - JEDEC: DO-214-AB; Value: 1N5007; Published: 8-Jun-2000; Revision: July-2002: Re-released for DXP Platform.; Publisher: Altium Limited
J13 J17 = Header 8x1_2M
Q1-Q4 Q21-Q24 = MOSFET_N: N-Channel 30 V 5.7A (Ta) 1.4W (Ta) Surface Mount SOT-23-3; MF: Alpha & Omega Semiconductor; SnapEDA_Link: https://www.snapeda.com/parts/AO3400A/Alpha/view-part/?ref=snap; Package: SOT-23 Alpha &amp; Omega Semiconductor Inc.; Value: *; MP: AO3400A; Check_prices: https://www.snapeda.com/parts/AO3400A/Alpha/view-part/?ref=eda
R149-R156 R377-R384 R387 = _RES_B_2: RES
U47 = IC_PWM_PCA9685PW/Q900,118: No Description Available; Manufacturer_Name: NXP; Copyright: Copyright (C) 2025 Ultra Librarian. All rights reserved.; Manufacturer_Part_Number: PCA9685PW/Q900,118; RefDes: RefDes; Type: Type

## Sheet NTC.SchDoc
size 420 x 297 mm; SheetNumber: 16; SheetTotal: 21
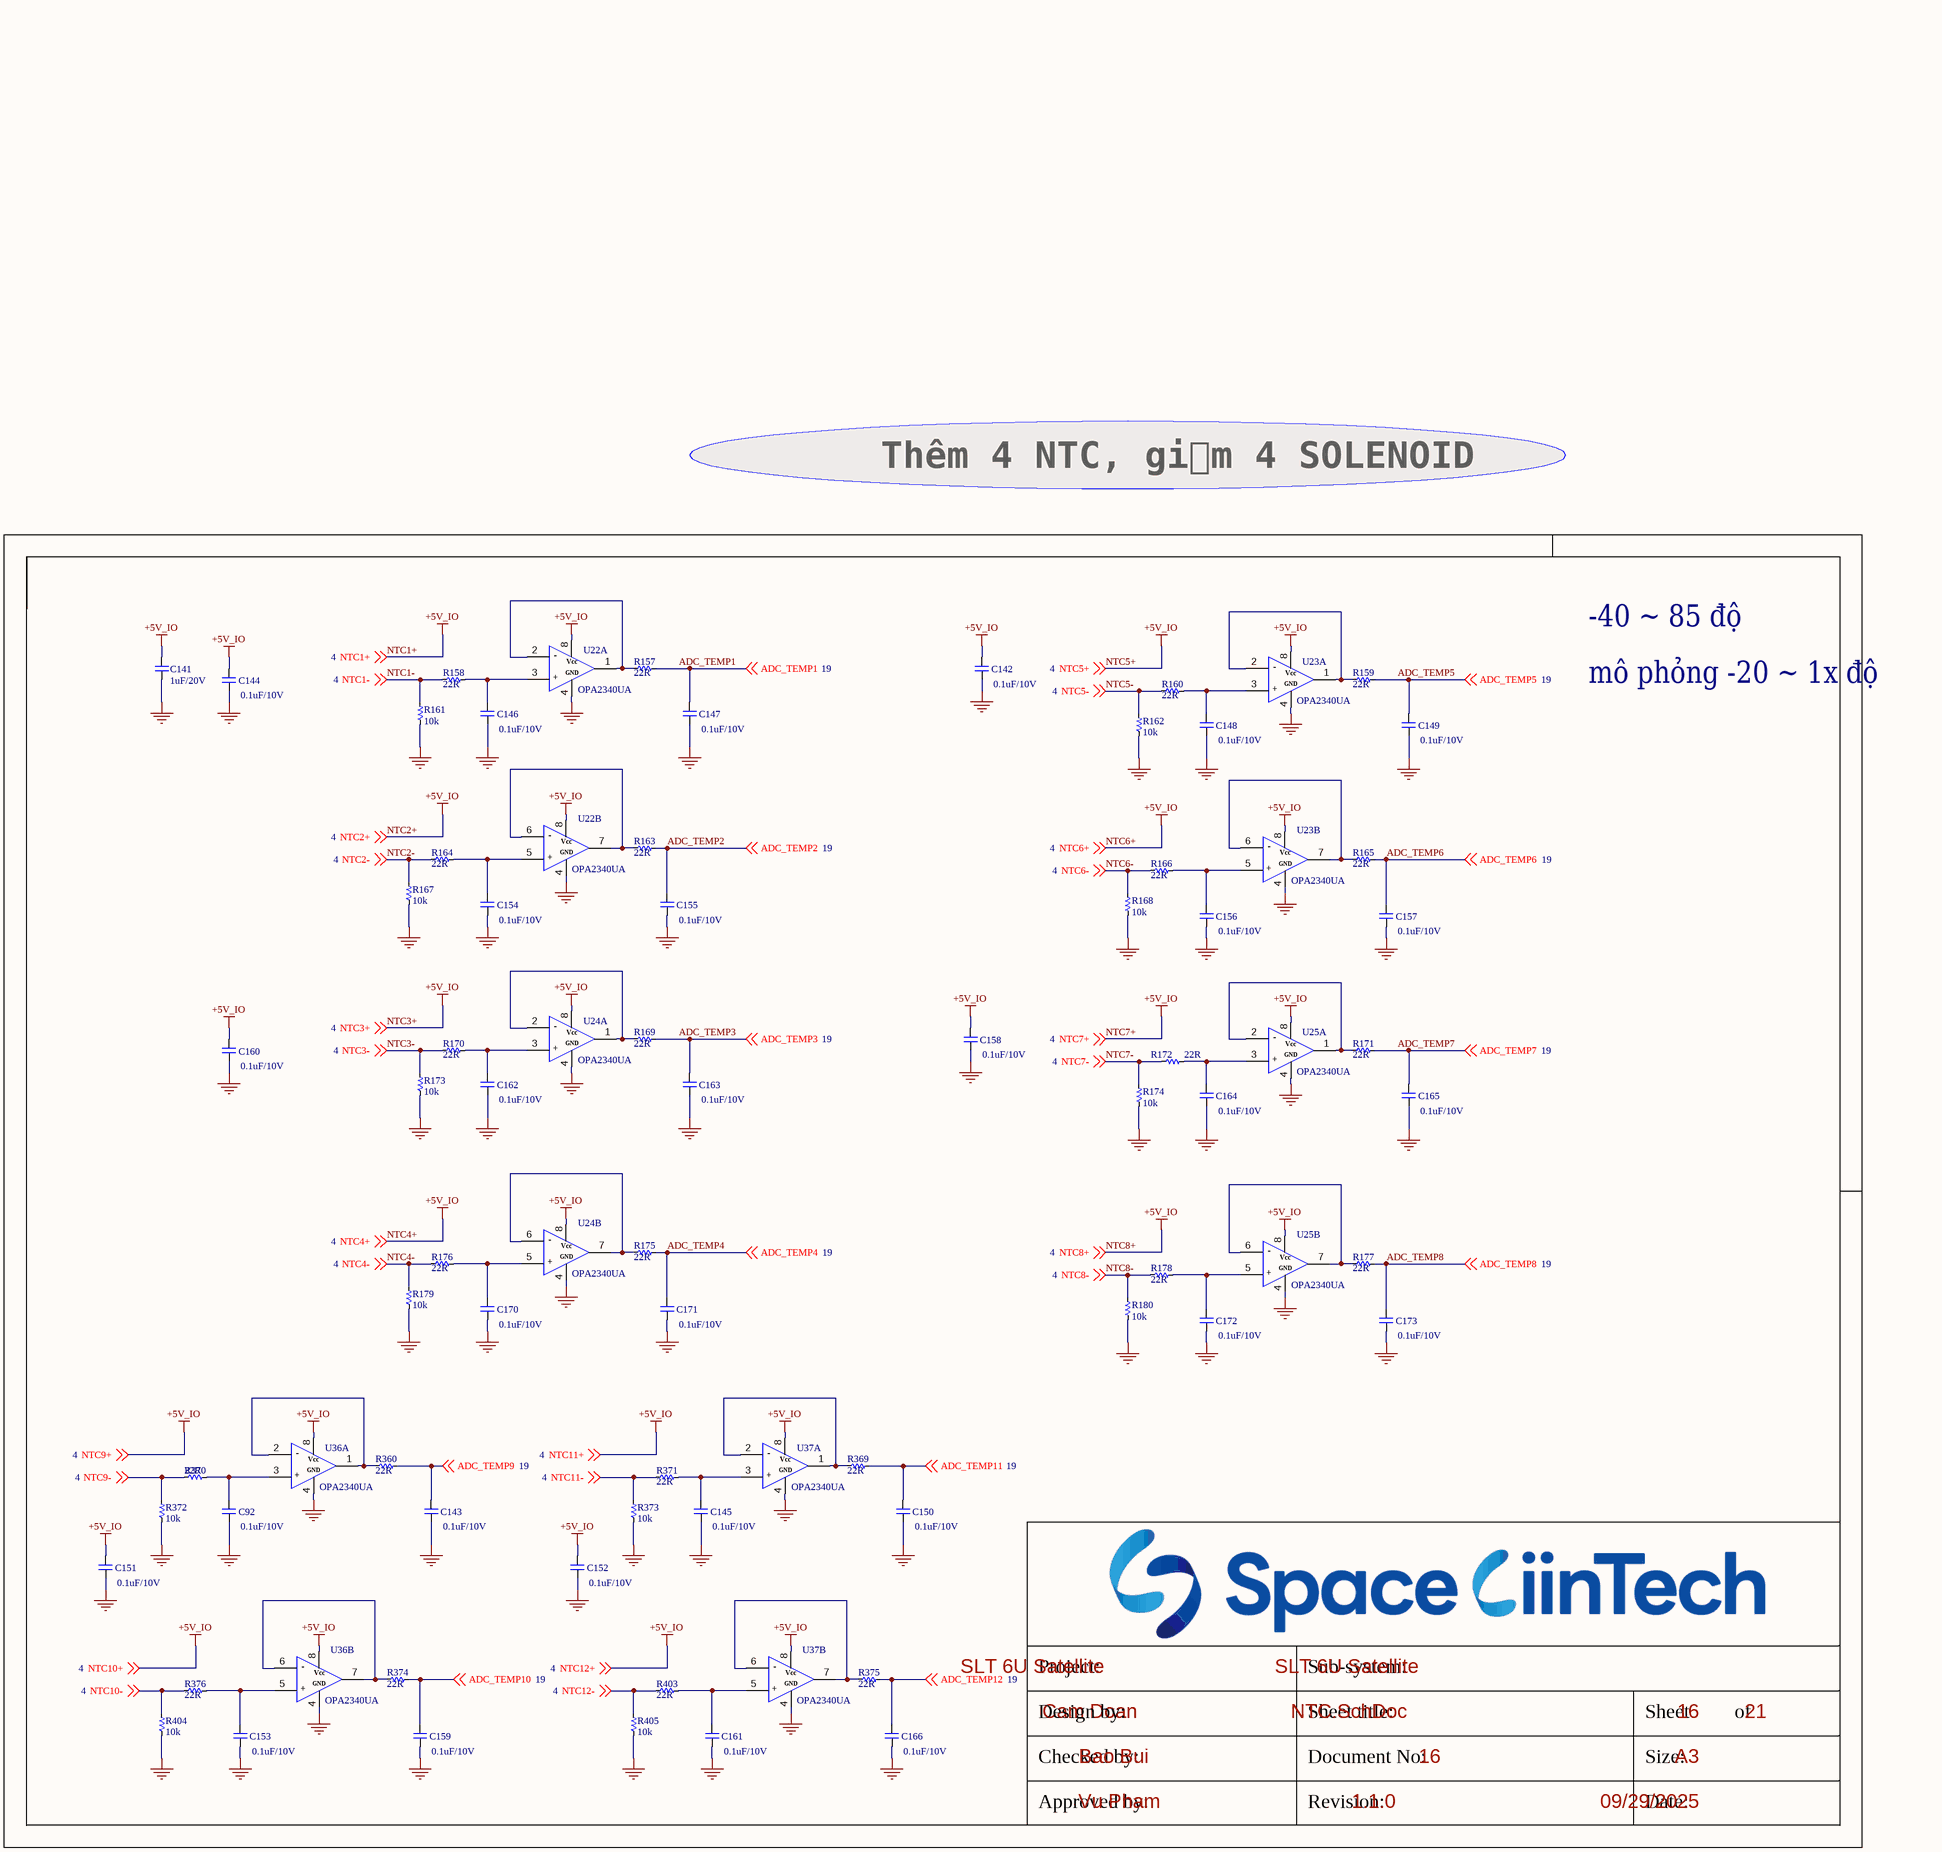
[diagram p14: NTC.SchDoc]

### Parts
C92  0.1uF/10V  [CAP_C_1005X60]
C141  1uF/20V  [CAP_C_1005X60]
C142  0.1uF/10V  [CAP_C_1005X60]
C143  0.1uF/10V  [CAP_C_1005X60]
C144  0.1uF/10V  [CAP_C_1005X60]
C145  0.1uF/10V  [CAP_C_1005X60]
C146  0.1uF/10V  [CAP_C_1005X60]
C147  0.1uF/10V  [CAP_C_1005X60]
C148  0.1uF/10V  [CAP_C_1005X60]
C149  0.1uF/10V  [CAP_C_1005X60]
C150  0.1uF/10V  [CAP_C_1005X60]
C151  0.1uF/10V  [CAP_C_1005X60]
C152  0.1uF/10V  [CAP_C_1005X60]
C153  0.1uF/10V  [CAP_C_1005X60]
C154  0.1uF/10V  [CAP_C_1005X60]
C155  0.1uF/10V  [CAP_C_1005X60]
C156  0.1uF/10V  [CAP_C_1005X60]
C157  0.1uF/10V  [CAP_C_1005X60]
C158  0.1uF/10V  [CAP_C_1005X60]
C159  0.1uF/10V  [CAP_C_1005X60]
C160  0.1uF/10V  [CAP_C_1005X60]
C161  0.1uF/10V  [CAP_C_1005X60]
C162  0.1uF/10V  [CAP_C_1005X60]
C163  0.1uF/10V  [CAP_C_1005X60]
C164  0.1uF/10V  [CAP_C_1005X60]
C165  0.1uF/10V  [CAP_C_1005X60]
C166  0.1uF/10V  [CAP_C_1005X60]
C170  0.1uF/10V  [CAP_C_1005X60]
C171  0.1uF/10V  [CAP_C_1005X60]
C172  0.1uF/10V  [CAP_C_1005X60]
C173  0.1uF/10V  [CAP_C_1005X60]
R157  22R  [RES_C_1005X40]
R158  22R  [RES_C_1005X40]
R159  22R  [RES_C_1005X40]
R160  22R  [RES_C_1005X40]
R161  10k  [RES_C_1005X40]
R162  10k  [RES_C_1005X40]
R163  22R  [RES_C_1005X40]
R164  22R  [RES_C_1005X40]
R165  22R  [RES_C_1005X40]
R166  22R  [RES_C_1005X40]
R167  10k  [RES_C_1005X40]
R168  10k  [RES_C_1005X40]
R169  22R  [RES_C_1005X40]
R170  22R  [RES_C_1005X40]
R171  22R  [RES_C_1005X40]
R172  22R  [RES_C_1005X40]
R173  10k  [RES_C_1005X40]
R174  10k  [RES_C_1005X40]
R175  22R  [RES_C_1005X40]
R176  22R  [RES_C_1005X40]
R177  22R  [RES_C_1005X40]
R178  22R  [RES_C_1005X40]
R179  10k  [RES_C_1005X40]
R180  10k  [RES_C_1005X40]
R360  22R  [RES_C_1005X40]
R369  22R  [RES_C_1005X40]
R370  22R  [RES_C_1005X40]
R371  22R  [RES_C_1005X40]
R372  10k  [RES_C_1005X40]
R373  10k  [RES_C_1005X40]
R374  22R  [RES_C_1005X40]
R375  22R  [RES_C_1005X40]
R376  22R  [RES_C_1005X40]
R403  22R  [RES_C_1005X40]
R404  10k  [RES_C_1005X40]
R405  10k  [RES_C_1005X40]
U22  OPA2340UA  [SOIC127P602X173-8N]  (parts A,B of 2)
U23  OPA2340UA  [SOIC127P602X173-8N]  (parts A,B of 2)
U24  OPA2340UA  [SOIC127P602X173-8N]  (parts A,B of 2)
U25  OPA2340UA  [SOIC127P602X173-8N]  (parts A,B of 2)
U36  OPA2340UA  [SOIC127P602X173-8N]  (parts A,B of 2)
U37  OPA2340UA  [SOIC127P602X173-8N]  (parts A,B of 2)

### Nets
GND: C92.1 C141.1 C142.1 C143.1 C144.1 C145.1 C146.1 C147.1 C148.1 C149.1 C150.1 C151.1 C152.1 C153.1 C154.1 C155.1 C156.1 C157.1 C158.1 C159.1 C160.1 C161.1 C162.1 C163.1 C164.1 C165.1 C166.1 C170.1 C171.1 C172.1 C173.1 R161.1 R162.1 R167.1 R168.1 R173.1 R174.1 R179.1 R180.1 R372.1 R373.1 R404.1 R405.1 U22.4 U23.4 U24.4 U25.4 U36.4 U37.4
NTC1+: C141.2 C142.2 C144.2 C151.2 C152.2 C158.2 C160.2 U22.8 U23.8 U24.8 U25.8 U36.8 U37.8 ; off-sheet NTC1+, off-sheet NTC2+, off-sheet NTC3+, off-sheet NTC4+, off-sheet NTC5+, off-sheet NTC6+, off-sheet NTC7+, off-sheet NTC8+, off-sheet NTC9+, off-sheet NTC10+, off-sheet NTC11+, off-sheet NTC12+  [also labelled +5V_IO, NTC10+, NTC11+, NTC12+, NTC2+, NTC3+, NTC4+, NTC5+, NTC6+, NTC7+, NTC8+, NTC9+]
ADC_TEMP1: C147.2 R157.2 ; off-sheet ADC_TEMP1
ADC_TEMP2: C155.2 R163.2 ; off-sheet ADC_TEMP2
ADC_TEMP3: C163.2 R169.2 ; off-sheet ADC_TEMP3
ADC_TEMP4: C171.2 R175.2 ; off-sheet ADC_TEMP4
ADC_TEMP5: C149.2 R159.2 ; off-sheet ADC_TEMP5
ADC_TEMP6: C157.2 R165.2 ; off-sheet ADC_TEMP6
ADC_TEMP7: C165.2 R171.2 ; off-sheet ADC_TEMP7
ADC_TEMP8: C173.2 R177.2 ; off-sheet ADC_TEMP8
ADC_TEMP9: C143.2 R360.2 ; off-sheet ADC_TEMP9
ADC_TEMP10: C159.2 R374.2 ; off-sheet ADC_TEMP10
ADC_TEMP11: C150.2 R369.2 ; off-sheet ADC_TEMP11
ADC_TEMP12: C166.2 R375.2 ; off-sheet ADC_TEMP12
NTC1-: R158.1 R161.2 ; off-sheet NTC1-
NTC2-: R164.1 R167.2 ; off-sheet NTC2-
NTC3-: R170.1 R173.2 ; off-sheet NTC3-
NTC4-: R176.1 R179.2 ; off-sheet NTC4-
NTC5-: R160.1 R162.2 ; off-sheet NTC5-
NTC6-: R166.1 R168.2 ; off-sheet NTC6-
NTC7-: R172.1 R174.2 ; off-sheet NTC7-
NTC8-: R178.1 R180.2 ; off-sheet NTC8-
NTC9-: R370.1 R372.2 ; off-sheet NTC9-
NTC10-: R376.1 R404.2 ; off-sheet NTC10-
NTC11-: R371.1 R373.2 ; off-sheet NTC11-
NTC12-: R403.1 R405.2 ; off-sheet NTC12-
NetC92_2: C92.2 R370.2 U36.3
NetC145_2: C145.2 R371.2 U37.3
NetC146_2: C146.2 R158.2 U22.3
NetC148_2: C148.2 R160.2 U23.3
NetC153_2: C153.2 R376.2 U36.5
NetC154_2: C154.2 R164.2 U22.5
NetC156_2: C156.2 R166.2 U23.5
NetC161_2: C161.2 R403.2 U37.5
NetC162_2: C162.2 R170.2 U24.3
NetC164_2: C164.2 R172.2 U25.3
NetC170_2: C170.2 R176.2 U24.5
NetC172_2: C172.2 R178.2 U25.5
NetR157_1: R157.1 U22.1 U22.2
NetR159_1: R159.1 U23.1 U23.2
NetR163_1: R163.1 U22.6 U22.7
NetR165_1: R165.1 U23.6 U23.7
NetR169_1: R169.1 U24.1 U24.2
NetR171_1: R171.1 U25.1 U25.2
NetR175_1: R175.1 U24.6 U24.7
NetR177_1: R177.1 U25.6 U25.7
NetR360_1: R360.1 U36.1 U36.2
NetR369_1: R369.1 U37.1 U37.2
NetR374_1: R374.1 U36.6 U36.7
NetR375_1: R375.1 U37.6 U37.7

### Notes on the sheet
- Thêm 4 NTC, giảm 4 SOLENOID
- -40 ~ 85 độ
- mô phỏng -20 ~ 1x độ
- Project:
- Sub-system:
- Design by:
- Sheet title:
- Sheet
- of
- Checked by:
- Approved by:
- Revision:
- Document No:
- Size:
- Date:
- A3
- (in symbol OPA2340UA, part A) -; Vcc; GND; +
- (in symbol OPA2340UA, part B) -; Vcc; GND; +

### Library data of the parts
C92 C141-C166 C170-C173 = _CAP_C_2: CAP CHIP
R157-R180 R360 R369-R376 R403-R405 = _RES_B_2: RES

## Sheet FLUIDIC_CTRL.SchDoc
size 420 x 297 mm; SheetNumber: 17; SheetTotal: 21
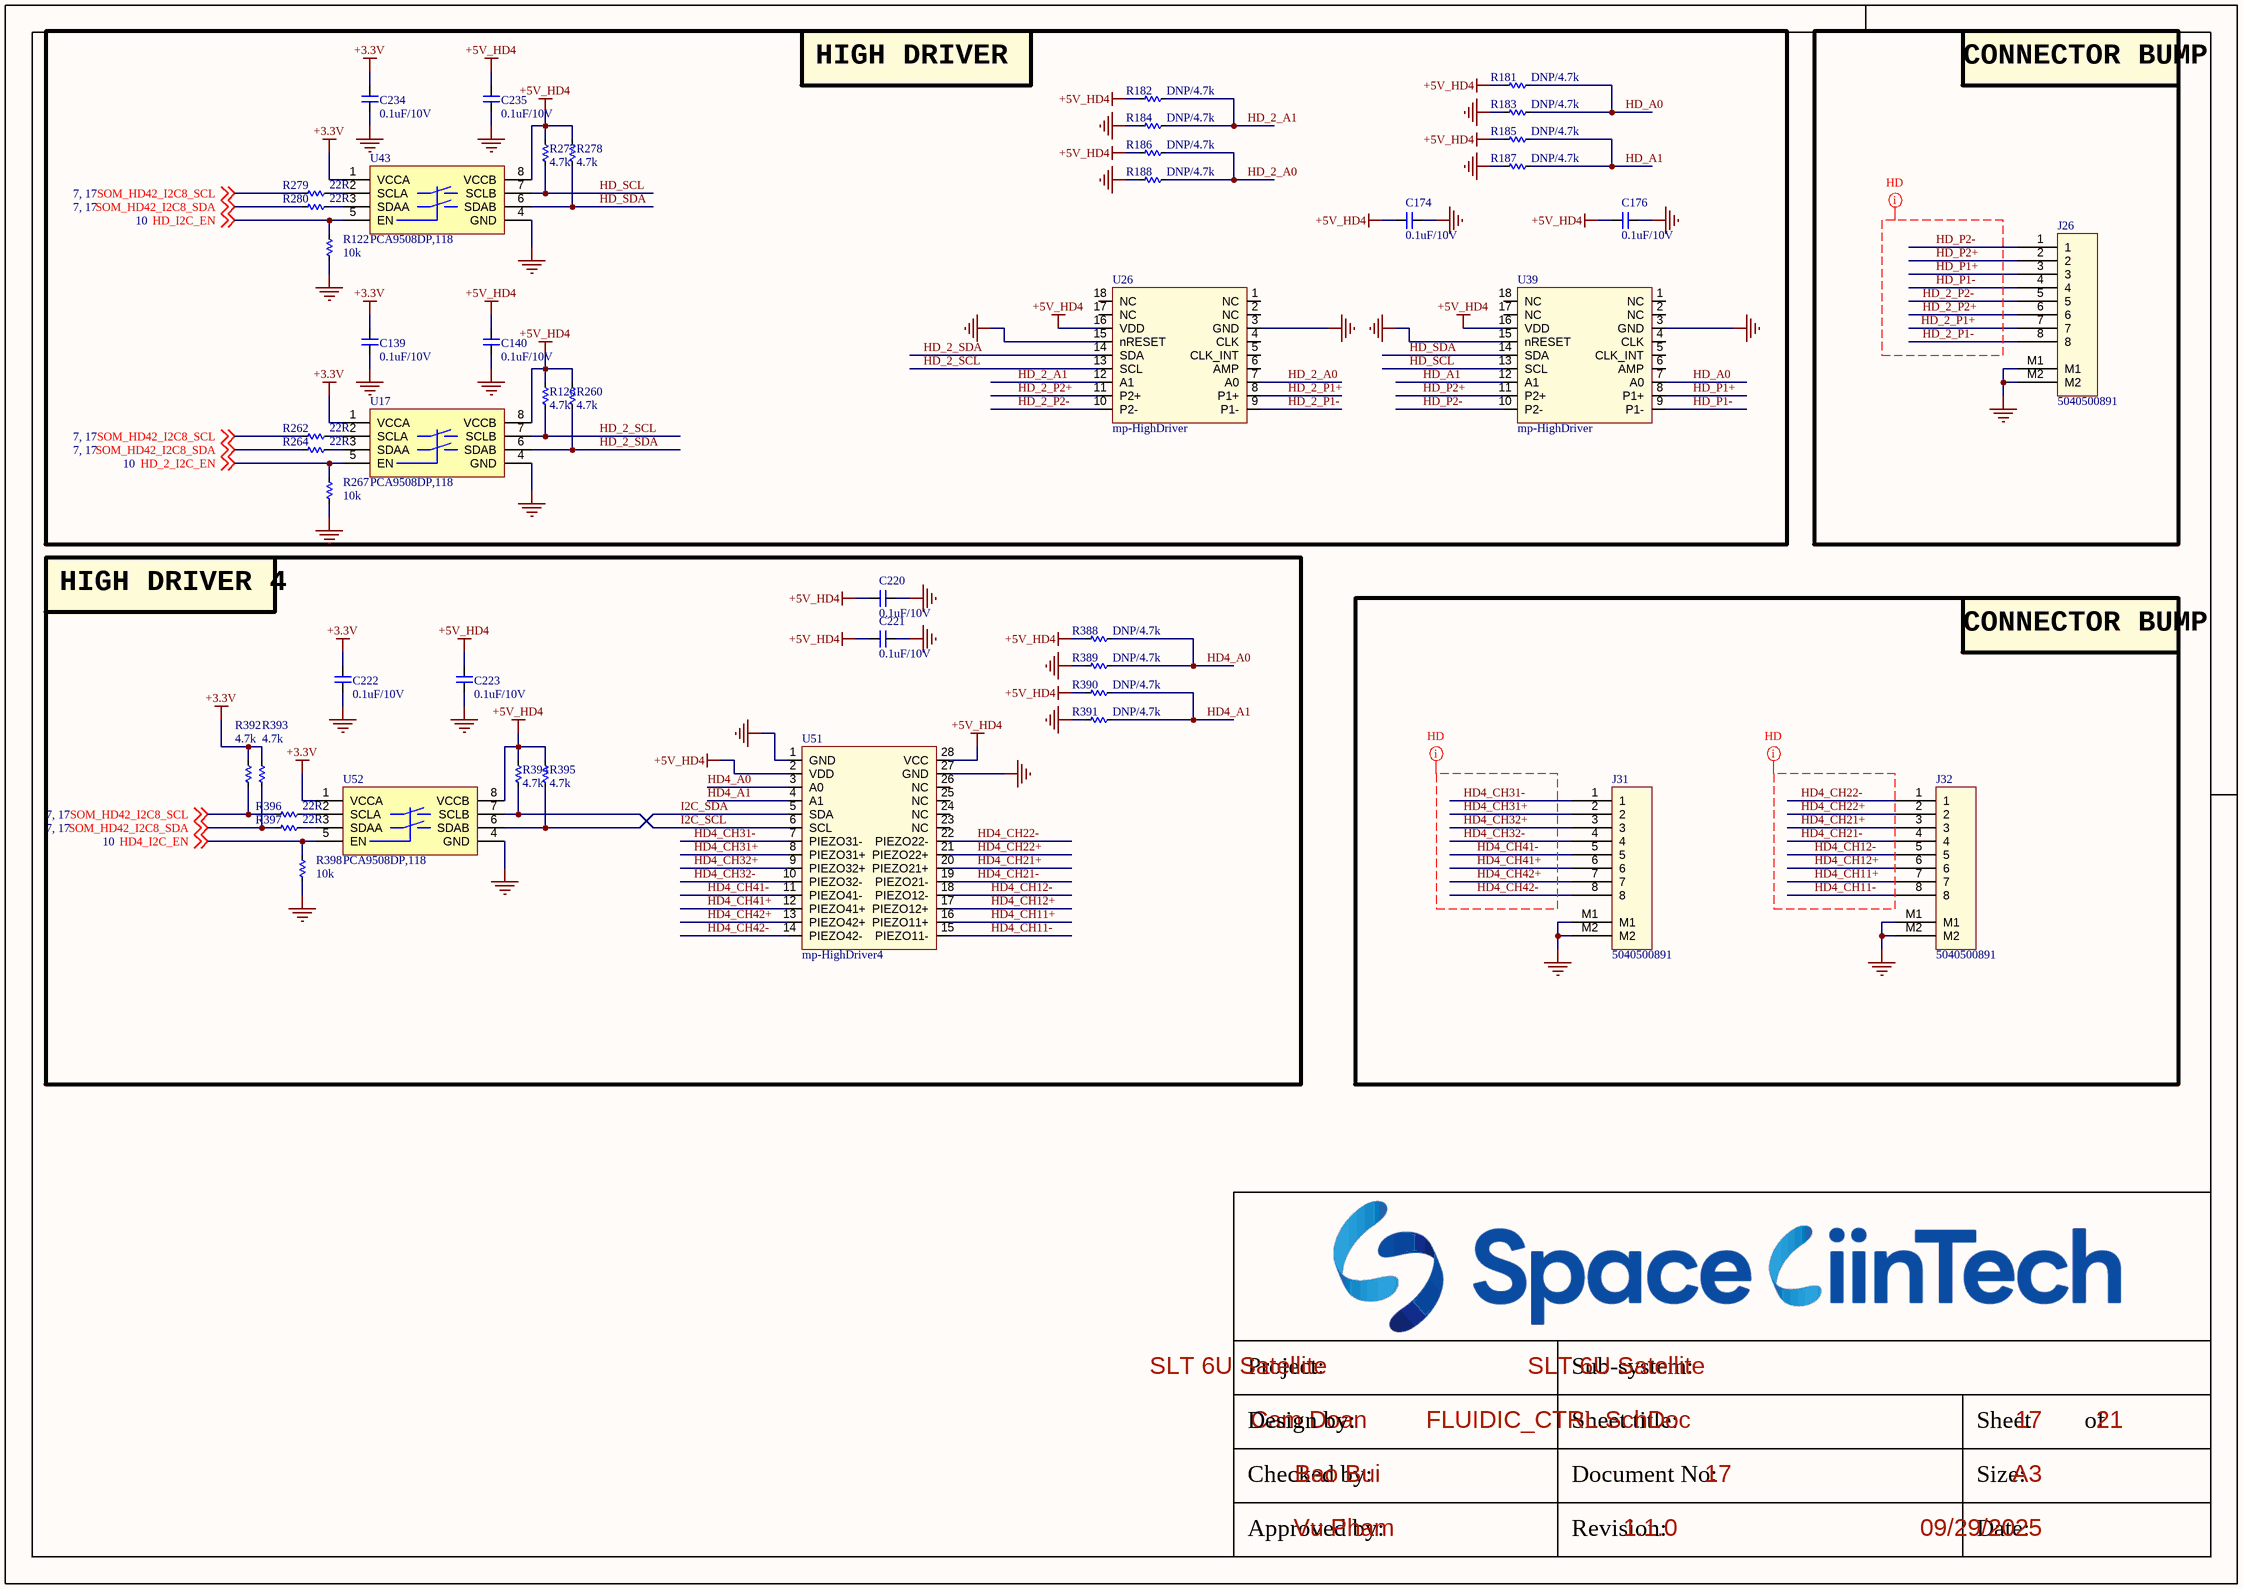
[diagram p15: FLUIDIC_CTRL.SchDoc]

### Parts
C139  0.1uF/10V  [CAP_C_1005X60]
C140  0.1uF/10V  [CAP_C_1005X60]
C174  0.1uF/10V  [CAP_C_1005X60]
C176  0.1uF/10V  [CAP_C_1005X60]
C220  0.1uF/10V  [CAP_C_1005X60]
C221  0.1uF/10V  [CAP_C_1005X60]
C222  0.1uF/10V  [CAP_C_1005X60]
C223  0.1uF/10V  [CAP_C_1005X60]
C234  0.1uF/10V  [CAP_C_1005X60]
C235  0.1uF/10V  [CAP_C_1005X60]
J26  5040500891  [MOLEX_5040500891]
J31  5040500891  [MOLEX_5040500891]
J32  5040500891  [MOLEX_5040500891]
R122  10k  [RES_C_1005X40]
R126  4.7k  [RES_C_1005X40]
R181  DNP/4.7k  [RES_C_1005X40]
R182  DNP/4.7k  [RES_C_1005X40]
R183  DNP/4.7k  [RES_C_1005X40]
R184  DNP/4.7k  [RES_C_1005X40]
R185  DNP/4.7k  [RES_C_1005X40]
R186  DNP/4.7k  [RES_C_1005X40]
R187  DNP/4.7k  [RES_C_1005X40]
R188  DNP/4.7k  [RES_C_1005X40]
R260  4.7k  [RES_C_1005X40]
R262  22R  [RES_C_1005X40]
R264  22R  [RES_C_1005X40]
R267  10k  [RES_C_1005X40]
R277  4.7k  [RES_C_1005X40]
R278  4.7k  [RES_C_1005X40]
R279  22R  [RES_C_1005X40]
R280  22R  [RES_C_1005X40]
R388  DNP/4.7k  [RES_C_1005X40]
R389  DNP/4.7k  [RES_C_1005X40]
R390  DNP/4.7k  [RES_C_1005X40]
R391  DNP/4.7k  [RES_C_1005X40]
R392  4.7k  [RES_C_1005X40]
R393  4.7k  [RES_C_1005X40]
R394  4.7k  [RES_C_1005X40]
R395  4.7k  [RES_C_1005X40]
R396  22R  [RES_C_1005X40]
R397  22R  [RES_C_1005X40]
R398  10k  [RES_C_1005X40]
U17  PCA9508DP,118  [TSOP8]
U26  mp-HighDriver  [MP_HIGHDRIVER]
U39  mp-HighDriver  [MP_HIGHDRIVER]
U43  PCA9508DP,118  [TSOP8]
U51  mp-HighDriver4  [MP_HIGHDRIVER4]
U52  PCA9508DP,118  [TSOP8]

### Blocks framed on the sheet
HIGH DRIVER: C139 C140 C174 C176 C234 C235 R122 R126 R181-R188 R260 R262 R264 R267 R277-R280 U17 U26 U39 U43
CONNECTOR BUMP: J26
HIGH DRIVER 4: C220-C223 R388-R398 U51 U52
CONNECTOR BUMP: J31 J32

### Nets
+3.3V: C139.2 C222.2 C234.2 R392.1 R393.1 U17.1(VCCA) U43.1(VCCA) U52.1(VCCA)
+5V_HD4: C140.2 C174.2 C176.2 C220.2 C221.2 C223.2 C235.2 R126.1 R181.1 R182.1 R185.1 R186.1 R260.1 R277.1 R278.1 R388.1 R390.1 R394.1 R395.1 U17.8(VCCB) U26.16(VDD) U39.16(VDD) U43.8(VCCB) U51.2(VDD) U51.28(VCC) U52.8(VCCB)
GND: C139.1 C140.1 C174.1 C176.1 C220.1 C221.1 C222.1 C223.1 C234.1 C235.1 J26.M1 J26.M2 J31.M1 J31.M2 J32.M1 J32.M2 R122.2 R183.1 R184.1 R187.1 R188.1 R267.2 R389.1 R391.1 R398.2 U17.4(GND) U26.3(GND) U26.15(nRESET) U39.3(GND) U39.15(nRESET) U43.4(GND) U51.1(GND) U51.27(GND) U52.4(GND)
HD4_A0: R388.2 R389.2 U51.3(A0)
HD4_A1: R390.2 R391.2 U51.4(A1)
HD4_CH11+: J32.7 U51.16(PIEZO11+)
HD4_CH11-: J32.8 U51.15(PIEZO11-)
HD4_CH12+: J32.6 U51.17(PIEZO12+)
HD4_CH12-: J32.5 U51.18(PIEZO12-)
HD4_CH21+: J32.3 U51.20(PIEZO21+)
HD4_CH21-: J32.4 U51.19(PIEZO21-)
HD4_CH22+: J32.2 U51.21(PIEZO22+)
HD4_CH22-: J32.1 U51.22(PIEZO22-)
HD4_CH31+: J31.2 U51.8(PIEZO31+)
HD4_CH31-: J31.1 U51.7(PIEZO31-)
HD4_CH32+: J31.3 U51.9(PIEZO32+)
HD4_CH32-: J31.4 U51.10(PIEZO32-)
HD4_CH41+: J31.6 U51.12(PIEZO41+)
HD4_CH41-: J31.5 U51.11(PIEZO41-)
HD4_CH42+: J31.7 U51.13(PIEZO42+)
HD4_CH42-: J31.8 U51.14(PIEZO42-)
HD4_I2C_EN: R398.1 U52.5(EN) ; off-sheet HD4_I2C_EN
HD_2_A0: R186.2 R188.2 U26.7(A0)
HD_2_A1: R182.2 R184.2 U26.12(A1)
HD_2_I2C_EN: R267.1 U17.5(EN) ; off-sheet HD_2_I2C_EN
HD_2_P1+: J26.7 U26.8(P1+)
HD_2_P1-: J26.8 U26.9(P1-)
HD_2_P2+: J26.6 U26.11(P2+)
HD_2_P2-: J26.5 U26.10(P2-)
HD_2_SCL: R126.2 U17.7(SCLB) U26.13(SCL)
HD_2_SDA: R260.2 U17.6(SDAB) U26.14(SDA)
HD_A0: R181.2 R183.2 U39.7(A0)
HD_A1: R185.2 R187.2 U39.12(A1)
HD_I2C_EN: R122.1 U43.5(EN) ; off-sheet HD_I2C_EN
HD_P1+: J26.3 U39.8(P1+)
HD_P1-: J26.4 U39.9(P1-)
HD_P2+: J26.2 U39.11(P2+)
HD_P2-: J26.1 U39.10(P2-)
HD_SCL: R277.2 U39.13(SCL) U43.7(SCLB)
HD_SDA: R278.2 U39.14(SDA) U43.6(SDAB)
I2C_SCL: R394.2 U51.6(SCL) U52.7(SCLB)
I2C_SDA: R395.2 U51.5(SDA) U52.6(SDAB)
SOM_HD42_I2C8_SCL: R262.2 R279.2 R392.2 R396.2 ; off-sheet SOM_HD42_I2C8_SCL
SOM_HD42_I2C8_SDA: R264.2 R280.2 R393.2 R397.2 ; off-sheet SOM_HD42_I2C8_SDA
NetR262_1: R262.1 U17.2(SCLA)
NetR264_1: R264.1 U17.3(SDAA)
NetR279_1: R279.1 U43.2(SCLA)
NetR280_1: R280.1 U43.3(SDAA)
NetR396_1: R396.1 U52.2(SCLA)
NetR397_1: R397.1 U52.3(SDAA)

Not connected (* = marked no-connect by the designer): U26 1(NC) 2(NC) 4(CLK) 5(CLK_INT) 6(AMP) 17(NC) 18(NC); U39 1(NC) 2(NC) 4(CLK) 5(CLK_INT) 6(AMP) 17(NC) 18(NC); U51 23(NC) 24(NC) 25(NC) 26(NC)

### Layout directives
net class HD: HD4_CH11+, HD4_CH11-, HD4_CH12+, HD4_CH12-, HD4_CH21+, HD4_CH21-, HD4_CH22+, HD4_CH22-, HD4_CH31+, HD4_CH31-, HD4_CH32+, HD4_CH32-, HD4_CH41+, HD4_CH41-, HD4_CH42+, HD4_CH42-, HD_2_P1+, HD_2_P1-, HD_2_P2+, HD_2_P2-, HD_P1+, HD_P1-, HD_P2+, HD_P2-

### Notes on the sheet
- Project:
- Sub-system:
- Design by:
- Sheet title:
- Sheet
- of
- Checked by:
- Approved by:
- Revision:
- Document No:
- Size:
- Date:
- A3

### Library data of the parts
C139 C140 C174 C176 C220-C223 C234 C235 = _CAP_C_2: CAP CHIP
J26 J31 J32 = Header 8x1_2M
R122 R126 R181-R188 R260 R262 R264 R267 R277-R280 R388-R398 = _RES_B_2: RES
U51 = mp_HighDriver4

## Sheet SOLEDNOID.SchDoc
size 420 x 297 mm; SheetNumber: 18; SheetTotal: 21
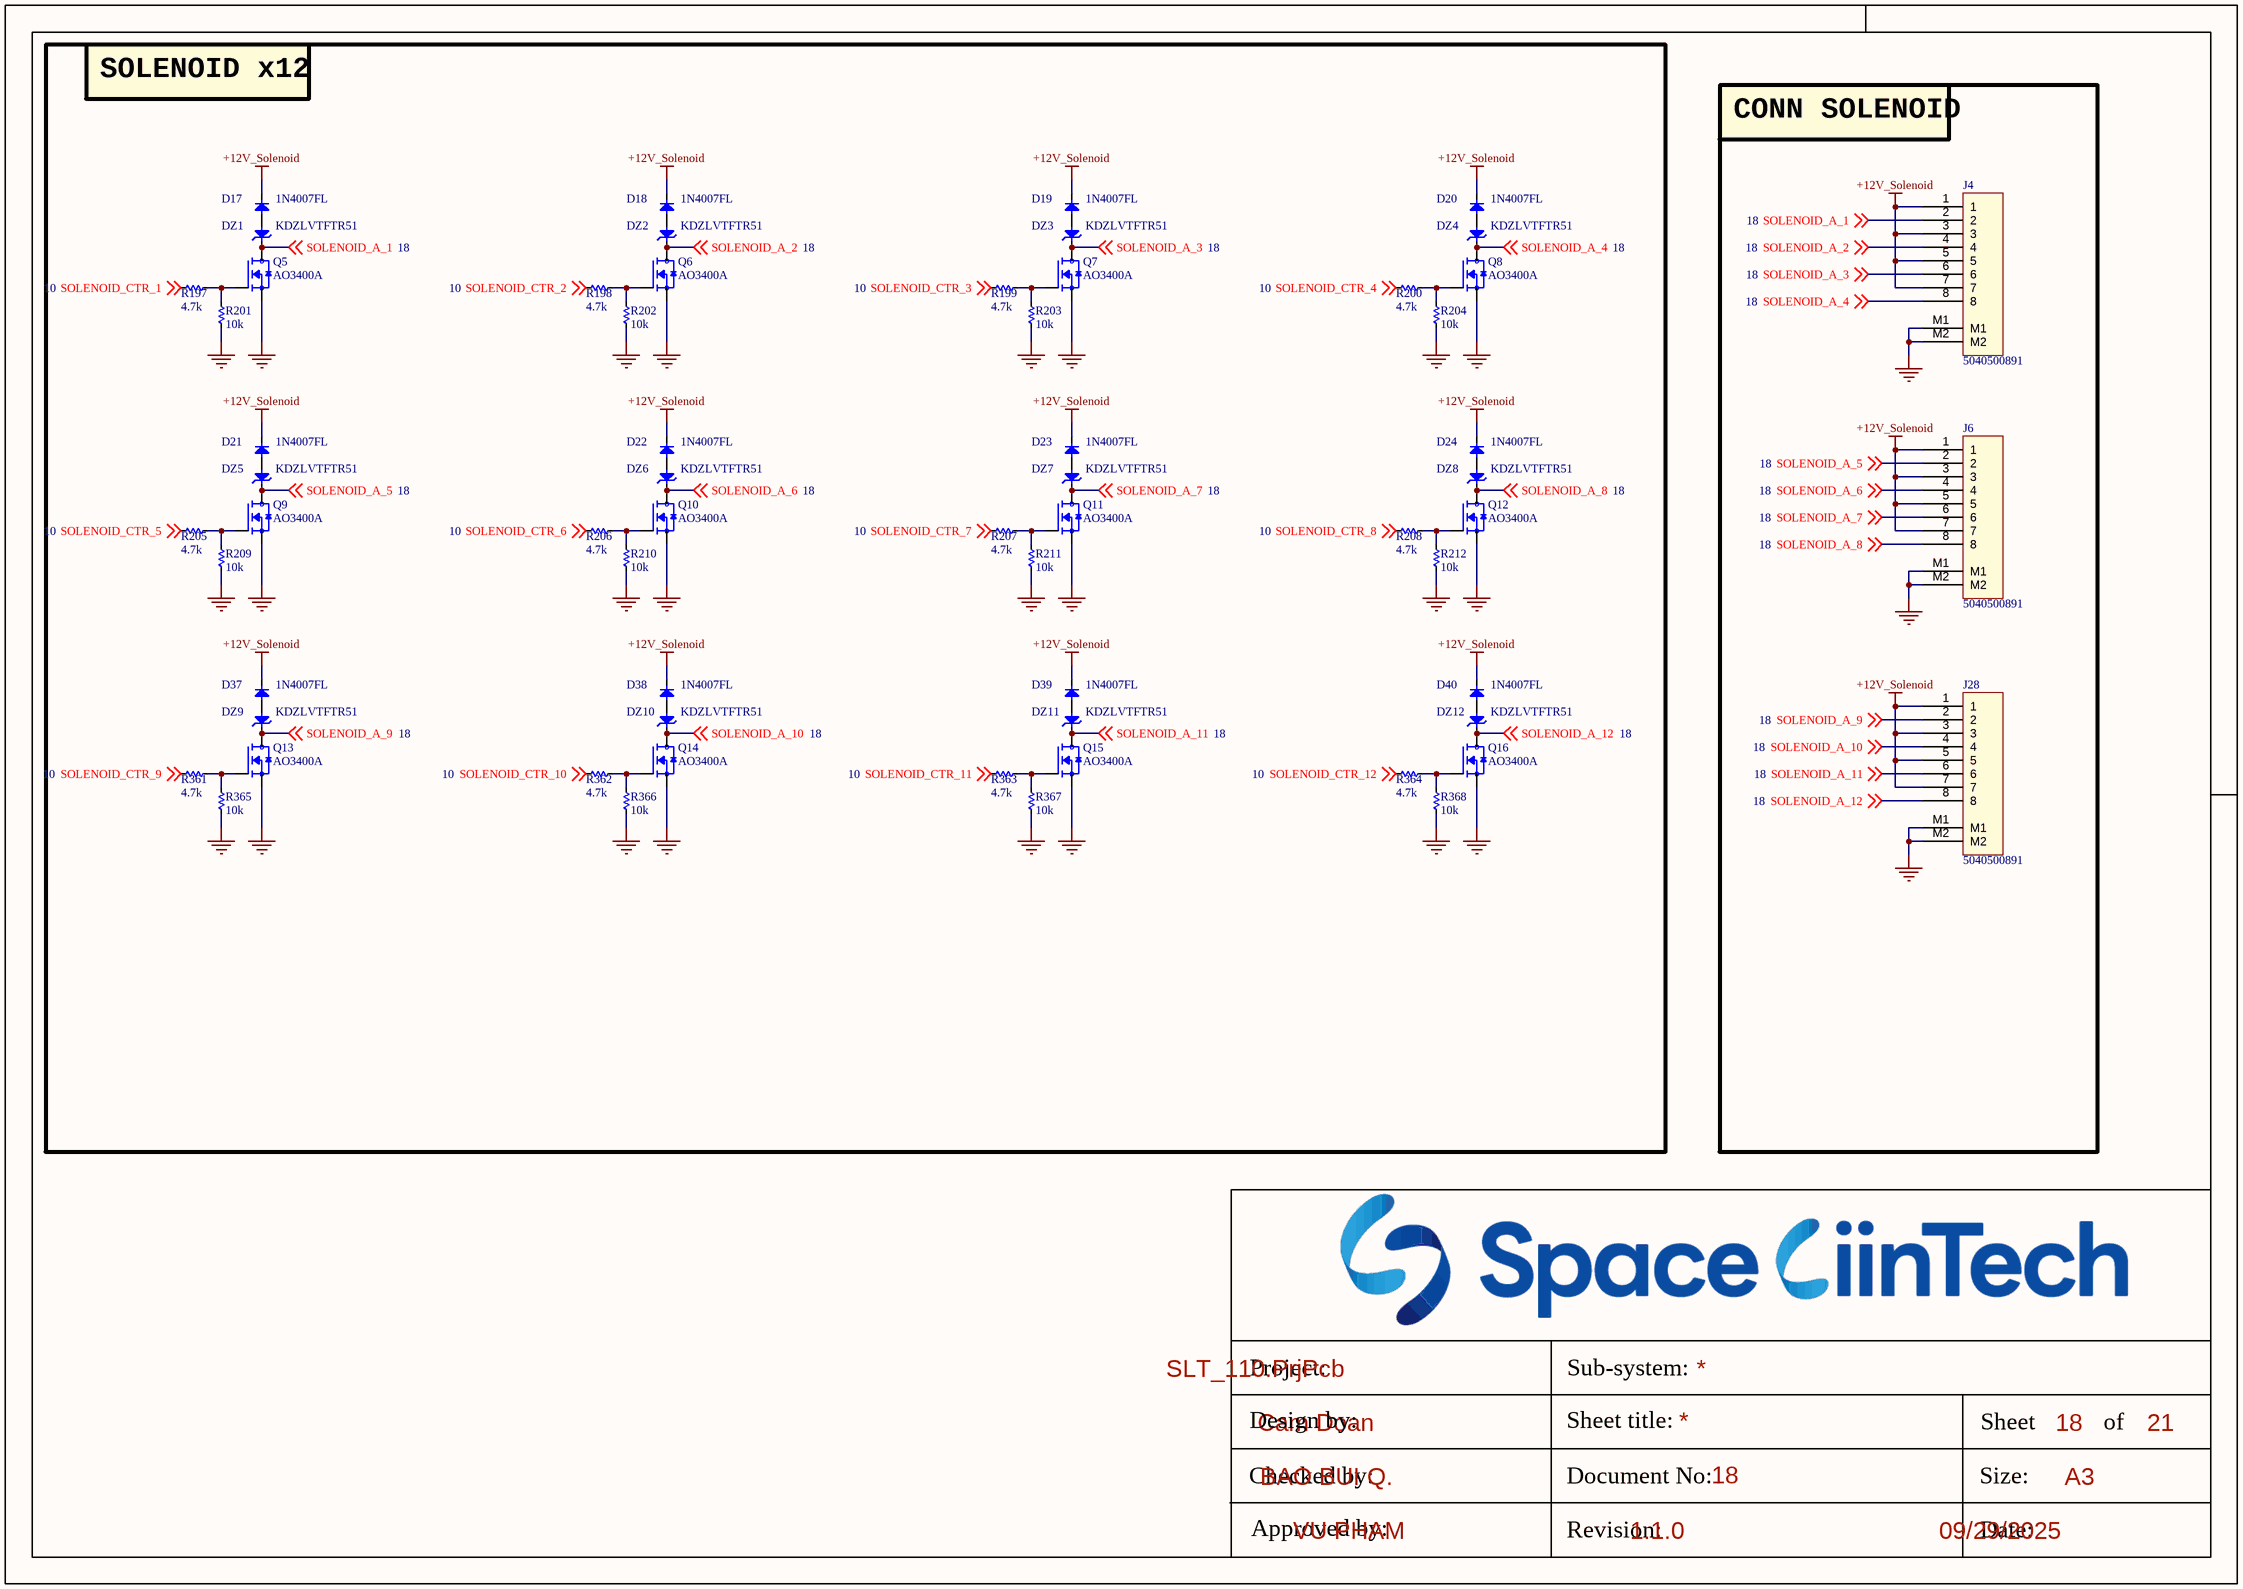
[diagram p16: SOLEDNOID.SchDoc]

### Parts
D17  1N4007FL  [SOD3717X145N]
D18  1N4007FL  [SOD3717X145N]
D19  1N4007FL  [SOD3717X145N]
D20  1N4007FL  [SOD3717X145N]
D21  1N4007FL  [SOD3717X145N]
D22  1N4007FL  [SOD3717X145N]
D23  1N4007FL  [SOD3717X145N]
D24  1N4007FL  [SOD3717X145N]
D37  1N4007FL  [SOD3717X145N]
D38  1N4007FL  [SOD3717X145N]
D39  1N4007FL  [SOD3717X145N]
D40  1N4007FL  [SOD3717X145N]
DZ1  KDZLVTFTR51  [SOD3717X145N]
DZ2  KDZLVTFTR51  [SOD3717X145N]
DZ3  KDZLVTFTR51  [SOD3717X145N]
DZ4  KDZLVTFTR51  [SOD3717X145N]
DZ5  KDZLVTFTR51  [SOD3717X145N]
DZ6  KDZLVTFTR51  [SOD3717X145N]
DZ7  KDZLVTFTR51  [SOD3717X145N]
DZ8  KDZLVTFTR51  [SOD3717X145N]
DZ9  KDZLVTFTR51  [SOD3717X145N]
DZ10  KDZLVTFTR51  [SOD3717X145N]
DZ11  KDZLVTFTR51  [SOD3717X145N]
DZ12  KDZLVTFTR51  [SOD3717X145N]
J4  5040500891  [MOLEX_5040500891]
J6  5040500891  [MOLEX_5040500891]
J28  5040500891  [MOLEX_5040500891]
Q5  AO3400A  [SOT95P240X120-3N]
Q6  AO3400A  [SOT95P240X120-3N]
Q7  AO3400A  [SOT95P240X120-3N]
Q8  AO3400A  [SOT95P240X120-3N]
Q9  AO3400A  [SOT95P240X120-3N]
Q10  AO3400A  [SOT95P240X120-3N]
Q11  AO3400A  [SOT95P240X120-3N]
Q12  AO3400A  [SOT95P240X120-3N]
Q13  AO3400A  [SOT95P240X120-3N]
Q14  AO3400A  [SOT95P240X120-3N]
Q15  AO3400A  [SOT95P240X120-3N]
Q16  AO3400A  [SOT95P240X120-3N]
R197  4.7k  [RES_C_1005X40]
R198  4.7k  [RES_C_1005X40]
R199  4.7k  [RES_C_1005X40]
R200  4.7k  [RES_C_1005X40]
R201  10k  [RES_C_1005X40]
R202  10k  [RES_C_1005X40]
R203  10k  [RES_C_1005X40]
R204  10k  [RES_C_1005X40]
R205  4.7k  [RES_C_1005X40]
R206  4.7k  [RES_C_1005X40]
R207  4.7k  [RES_C_1005X40]
R208  4.7k  [RES_C_1005X40]
R209  10k  [RES_C_1005X40]
R210  10k  [RES_C_1005X40]
R211  10k  [RES_C_1005X40]
R212  10k  [RES_C_1005X40]
R361  4.7k  [RES_C_1005X40]
R362  4.7k  [RES_C_1005X40]
R363  4.7k  [RES_C_1005X40]
R364  4.7k  [RES_C_1005X40]
R365  10k  [RES_C_1005X40]
R366  10k  [RES_C_1005X40]
R367  10k  [RES_C_1005X40]
R368  10k  [RES_C_1005X40]

### Blocks framed on the sheet
SOLENOID x12: D17-D24 D37-D40 DZ1-DZ12 Q5-Q16 R197-R212 R361-R368
CONN SOLENOID: J4 J6 J28

### Nets
+12V_Solenoid: D17.1(K) D18.1(K) D19.1(K) D20.1(K) D21.1(K) D22.1(K) D23.1(K) D24.1(K) D37.1(K) D38.1(K) D39.1(K) D40.1(K) J4.1 J4.3 J4.5 J4.7 J6.1 J6.3 J6.5 J6.7 J28.1 J28.3 J28.5 J28.7
GND: J4.M1 J4.M2 J6.M1 J6.M2 J28.M1 J28.M2 Q5.2(S) Q6.2(S) Q7.2(S) Q8.2(S) Q9.2(S) Q10.2(S) Q11.2(S) Q12.2(S) Q13.2(S) Q14.2(S) Q15.2(S) Q16.2(S) R201.1 R202.1 R203.1 R204.1 R209.1 R210.1 R211.1 R212.1 R365.1 R366.1 R367.1 R368.1
SOLENOID_A_1: DZ1.1(K) J4.2 Q5.3(D) ; off-sheet SOLENOID_A_1
SOLENOID_A_2: DZ2.1(K) J4.4 Q6.3(D) ; off-sheet SOLENOID_A_2
SOLENOID_A_3: DZ3.1(K) J4.6 Q7.3(D) ; off-sheet SOLENOID_A_3
SOLENOID_A_4: DZ4.1(K) J4.8 Q8.3(D) ; off-sheet SOLENOID_A_4
SOLENOID_A_5: DZ5.1(K) J6.2 Q9.3(D) ; off-sheet SOLENOID_A_5
SOLENOID_A_6: DZ6.1(K) J6.4 Q10.3(D) ; off-sheet SOLENOID_A_6
SOLENOID_A_7: DZ7.1(K) J6.6 Q11.3(D) ; off-sheet SOLENOID_A_7
SOLENOID_A_8: DZ8.1(K) J6.8 Q12.3(D) ; off-sheet SOLENOID_A_8
SOLENOID_A_9: DZ9.1(K) J28.2 Q13.3(D) ; off-sheet SOLENOID_A_9
SOLENOID_A_10: DZ10.1(K) J28.4 Q14.3(D) ; off-sheet SOLENOID_A_10
SOLENOID_A_11: DZ11.1(K) J28.6 Q15.3(D) ; off-sheet SOLENOID_A_11
SOLENOID_A_12: DZ12.1(K) J28.8 Q16.3(D) ; off-sheet SOLENOID_A_12
SOLENOID_CTR_1: R197.2 ; off-sheet SOLENOID_CTR_1
SOLENOID_CTR_2: R198.2 ; off-sheet SOLENOID_CTR_2
SOLENOID_CTR_3: R199.2 ; off-sheet SOLENOID_CTR_3
SOLENOID_CTR_4: R200.2 ; off-sheet SOLENOID_CTR_4
SOLENOID_CTR_5: R205.2 ; off-sheet SOLENOID_CTR_5
SOLENOID_CTR_6: R206.2 ; off-sheet SOLENOID_CTR_6
SOLENOID_CTR_7: R207.2 ; off-sheet SOLENOID_CTR_7
SOLENOID_CTR_8: R208.2 ; off-sheet SOLENOID_CTR_8
SOLENOID_CTR_9: R361.2 ; off-sheet SOLENOID_CTR_9
SOLENOID_CTR_10: R362.2 ; off-sheet SOLENOID_CTR_10
SOLENOID_CTR_11: R363.2 ; off-sheet SOLENOID_CTR_11
SOLENOID_CTR_12: R364.2 ; off-sheet SOLENOID_CTR_12
NetD17_2: D17.2(A) DZ1.2(A)
NetD18_2: D18.2(A) DZ2.2(A)
NetD19_2: D19.2(A) DZ3.2(A)
NetD20_2: D20.2(A) DZ4.2(A)
NetD21_2: D21.2(A) DZ5.2(A)
NetD22_2: D22.2(A) DZ6.2(A)
NetD23_2: D23.2(A) DZ7.2(A)
NetD24_2: D24.2(A) DZ8.2(A)
NetD37_2: D37.2(A) DZ9.2(A)
NetD38_2: D38.2(A) DZ10.2(A)
NetD39_2: D39.2(A) DZ11.2(A)
NetD40_2: D40.2(A) DZ12.2(A)
NetQ5_1: Q5.1(G) R197.1 R201.2
NetQ6_1: Q6.1(G) R198.1 R202.2
NetQ7_1: Q7.1(G) R199.1 R203.2
NetQ8_1: Q8.1(G) R200.1 R204.2
NetQ9_1: Q9.1(G) R205.1 R209.2
NetQ10_1: Q10.1(G) R206.1 R210.2
NetQ11_1: Q11.1(G) R207.1 R211.2
NetQ12_1: Q12.1(G) R208.1 R212.2
NetQ13_1: Q13.1(G) R361.1 R365.2
NetQ14_1: Q14.1(G) R362.1 R366.2
NetQ15_1: Q15.1(G) R363.1 R367.2
NetQ16_1: Q16.1(G) R364.1 R368.2

### Notes on the sheet
- Project:
- Sub-system:
- Design by:
- BAO BUI Q.
- Sheet title:
- Sheet
- A3
- of
- Checked by:
- Approved by:
- VU PHAM
- Revision:
- Document No:
- Size:
- Date:

### Library data of the parts
D17-D24 D37-D40 = Diode SMD: as D32 on sheet HEATER; Published: 8-Jun-2000; Revision: July-2002: Re-released for DXP Platform.; Publisher: Altium Limited
DZ1-DZ12 = DIODE Zener: Zenner
J4 J6 J28 = Header 8x1_2M
Q5-Q16 = MOSFET_N: as Q1 on sheet HEATER; SnapEDA_Link: https://www.snapeda.com/parts/AO3400A/Alpha/view-part/?ref=snap; Package: SOT-23 Alpha &amp; Omega Semiconductor Inc.; Value: *; MP: AO3400A; Check_prices: https://www.snapeda.com/parts/AO3400A/Alpha/view-part/?ref=eda
R197-R212 R361-R368 = _RES_B_2: RES

## Sheet ADC.SchDoc
size 420 x 297 mm; SheetNumber: 19; SheetTotal: 21
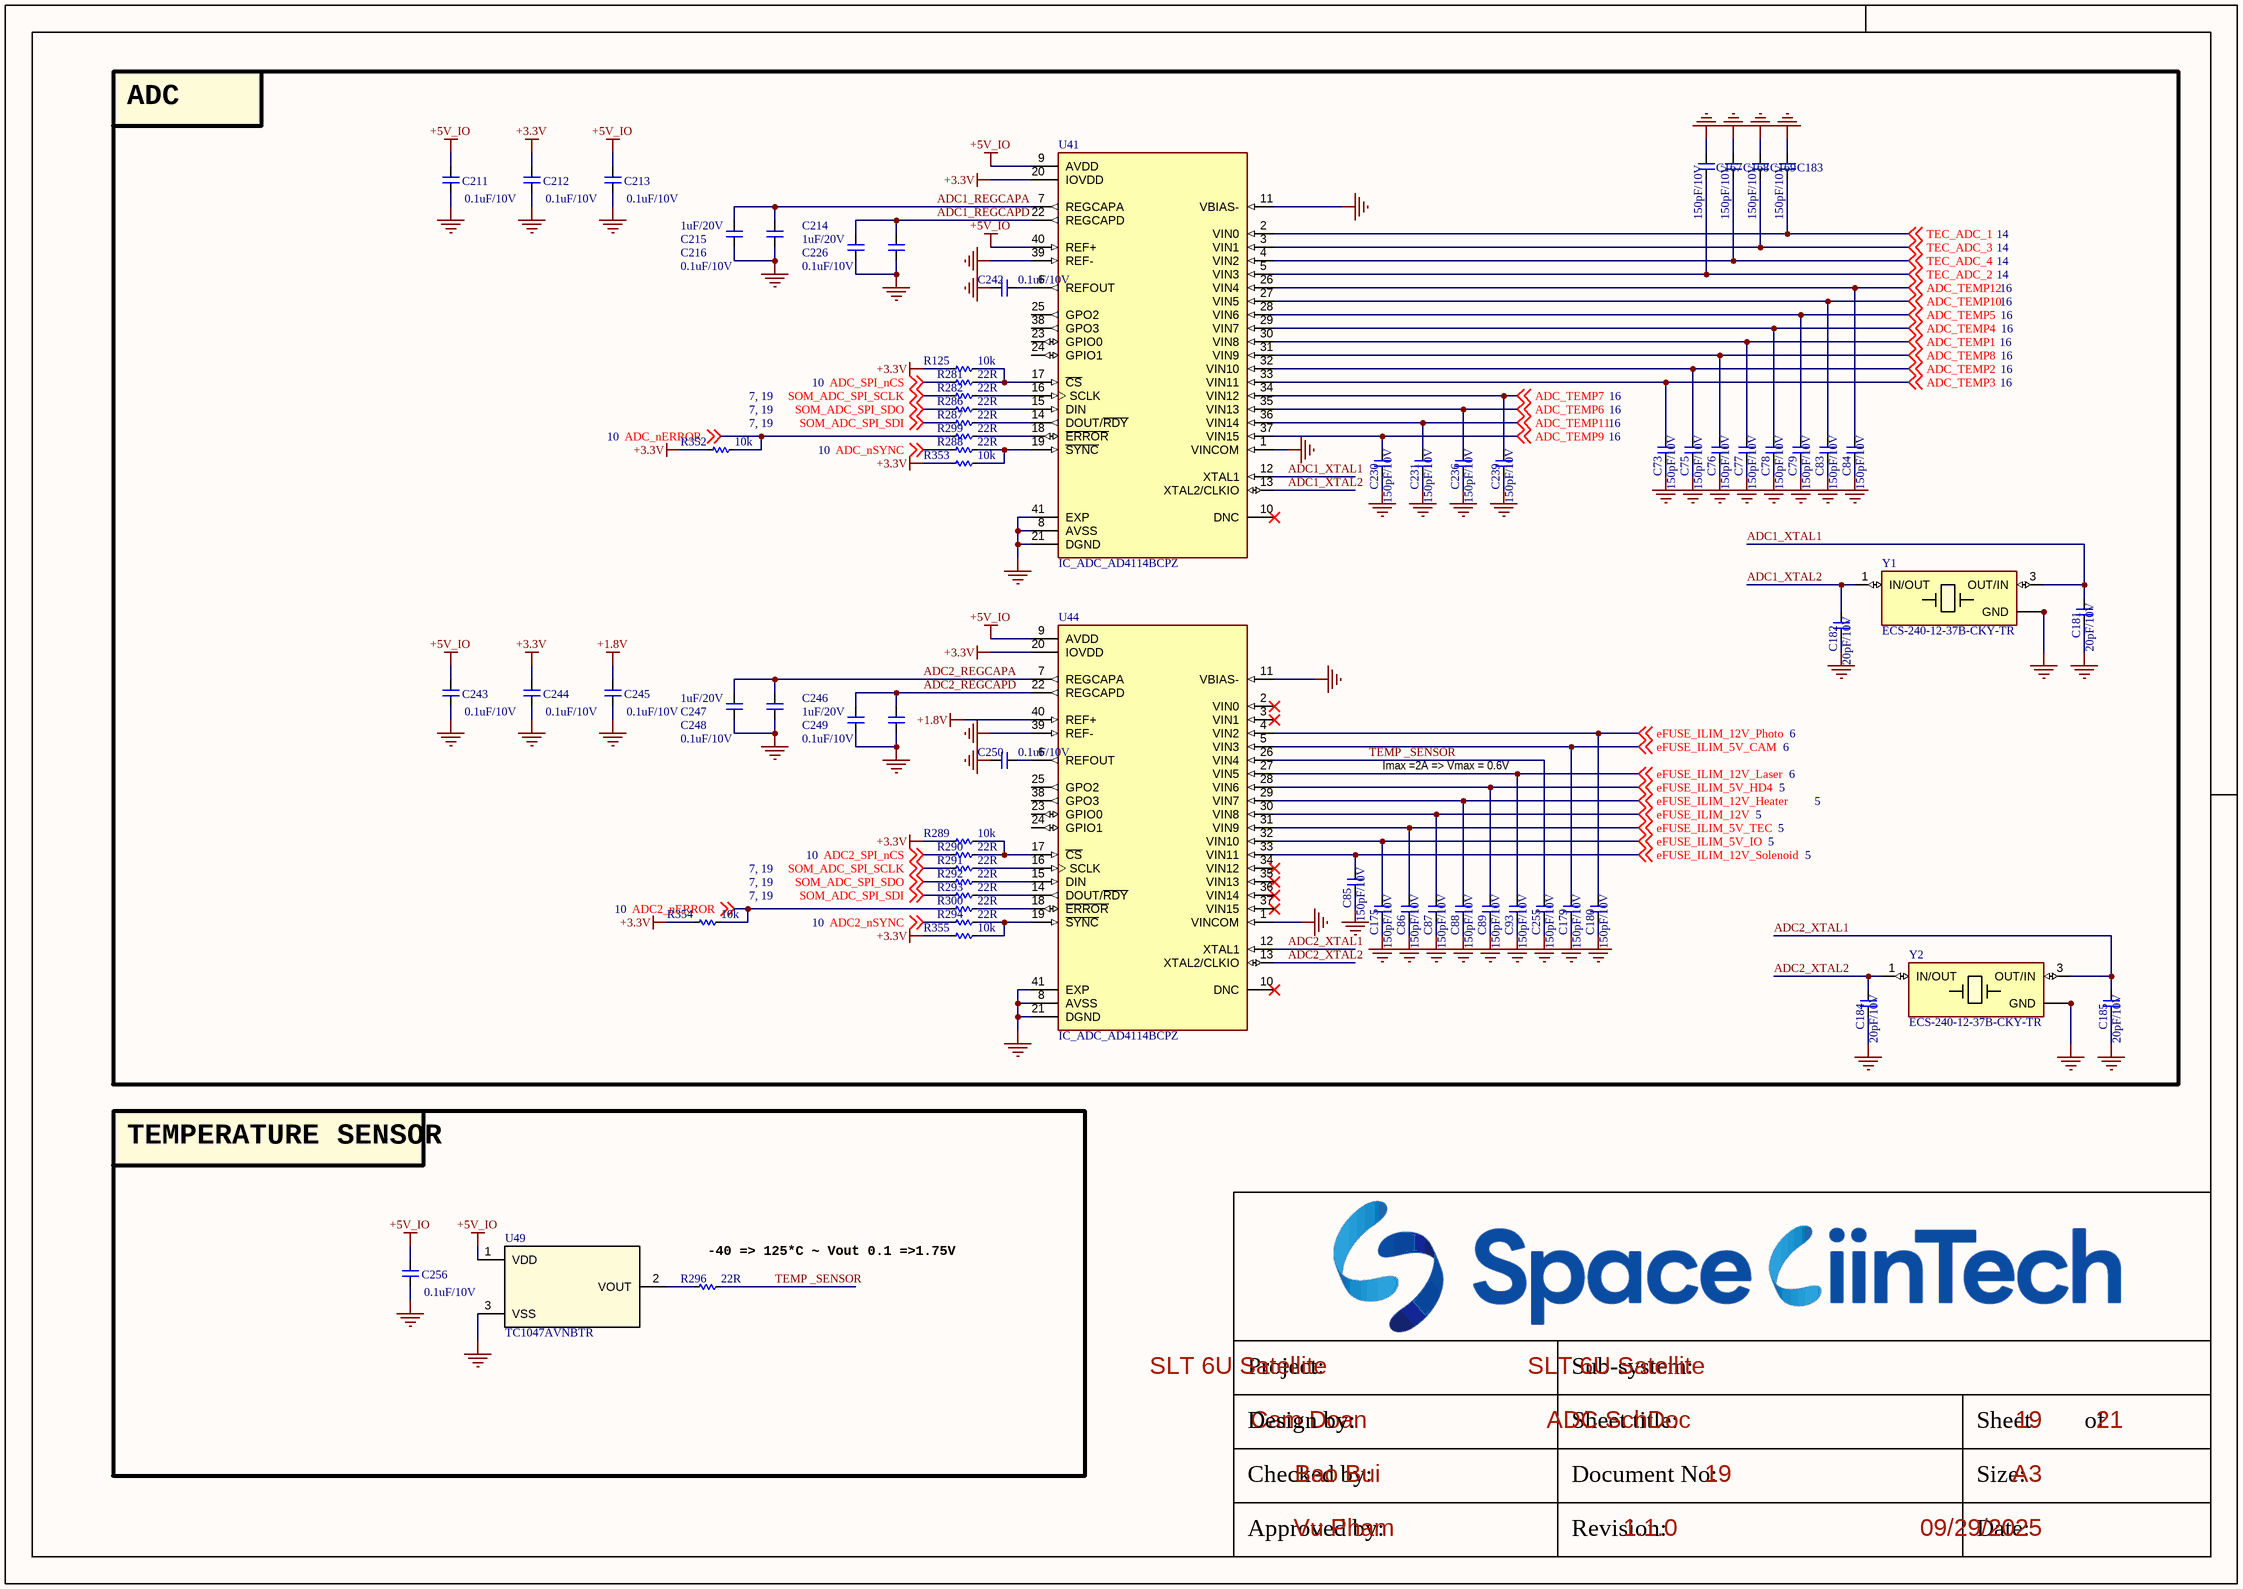
[diagram p17: ADC.SchDoc]

### Parts
C73  150pF/10V  [CAP_C_1005X60]
C75  150pF/10V  [CAP_C_1005X60]
C76  150pF/10V  [CAP_C_1005X60]
C77  150pF/10V  [CAP_C_1005X60]
C78  150pF/10V  [CAP_C_1005X60]
C79  150pF/10V  [CAP_C_1005X60]
C83  150pF/10V  [CAP_C_1005X60]
C84  150pF/10V  [CAP_C_1005X60]
C85  150pF/10V  [CAP_C_1005X60]
C86  150pF/10V  [CAP_C_1005X60]
C87  150pF/10V  [CAP_C_1005X60]
C88  150pF/10V  [CAP_C_1005X60]
C89  150pF/10V  [CAP_C_1005X60]
C93  150pF/10V  [CAP_C_1005X60]
C167  150pF/10V  [CAP_C_1005X60]
C168  150pF/10V  [CAP_C_1005X60]
C169  150pF/10V  [CAP_C_1005X60]
C175  150pF/10V  [CAP_C_1005X60]
C179  150pF/10V  [CAP_C_1005X60]
C180  150pF/10V  [CAP_C_1005X60]
C181  20pF/10V  [CAP_C_1005X60]
C182  20pF/10V  [CAP_C_1005X60]
C183  150pF/10V  [CAP_C_1005X60]
C184  20pF/10V  [CAP_C_1005X60]
C185  20pF/10V  [CAP_C_1005X60]
C211  0.1uF/10V  [CAP_C_1005X60]
C212  0.1uF/10V  [CAP_C_1005X60]
C213  0.1uF/10V  [CAP_C_1005X60]
C214  1uF/20V  [CAP_C_1005X60]
C215  1uF/20V  [CAP_C_1005X60]
C216  0.1uF/10V  [CAP_C_1005X60]
C226  0.1uF/10V  [CAP_C_1005X60]
C230  150pF/10V  [CAP_C_1005X60]
C231  150pF/10V  [CAP_C_1005X60]
C236  150pF/10V  [CAP_C_1005X60]
C239  150pF/10V  [CAP_C_1005X60]
C242  0.1uF/10V  [CAP_C_1005X60]
C243  0.1uF/10V  [CAP_C_1005X60]
C244  0.1uF/10V  [CAP_C_1005X60]
C245  0.1uF/10V  [CAP_C_1005X60]
C246  1uF/20V  [CAP_C_1005X60]
C247  1uF/20V  [CAP_C_1005X60]
C248  0.1uF/10V  [CAP_C_1005X60]
C249  0.1uF/10V  [CAP_C_1005X60]
C250  0.1uF/10V  [CAP_C_1005X60]
C255  150pF/10V  [CAP_C_1005X60]
C256  0.1uF/10V  [CAP_C_1005X60]
R125  10k  [RES_C_1005X40]
R281  22R  [RES_C_1005X40]
R282  22R  [RES_C_1005X40]
R286  22R  [RES_C_1005X40]
R287  22R  [RES_C_1005X40]
R288  22R  [RES_C_1005X40]
R289  10k  [RES_C_1005X40]
R290  22R  [RES_C_1005X40]
R291  22R  [RES_C_1005X40]
R292  22R  [RES_C_1005X40]
R293  22R  [RES_C_1005X40]
R294  22R  [RES_C_1005X40]
R296  22R  [RES_C_1005X40]
R299  22R  [RES_C_1005X40]
R300  22R  [RES_C_1005X40]
R352  10k  [RES_C_1005X40]
R353  10k  [RES_C_1005X40]
R354  10k  [RES_C_1005X40]
R355  10k  [RES_C_1005X40]
U41  IC_ADC_AD4114BCPZ  [QFN50P600X600X100-41N]
U44  IC_ADC_AD4114BCPZ  [QFN50P600X600X100-41N]
U49  TC1047AVNBTR  [SOT95P240X120-3N]
Y1  ECS-240-12-37B-CKY-TR  [XTAL_ECS-240-12-37B-CKY-TR]
Y2  ECS-240-12-37B-CKY-TR  [XTAL_ECS-240-12-37B-CKY-TR]

### Blocks framed on the sheet
ADC: C73 C75-C79 C83-C89 C93 C167-C169 C175 C179-C185 C211-C216 C226 C230 C231 C236 C239 C242-C250 C255 R125 R281 R282 R286-R294 R299 R300 R352-R355 U41 U44 Y1 Y2
TEMPERATURE SENSOR: C256 R296 U49

### Nets
+1.8V: C245.2 U44.40(REF+)
+3.3V: C212.2 C244.2 R125.2 R289.2 R352.2 R353.2 R354.2 R355.2 U41.20(IOVDD) U44.20(IOVDD)
+5V_IO: C211.2 C213.2 C243.2 C256.2 U41.9(AVDD) U41.40(REF+) U44.9(AVDD) U49.1(VDD)  [project net NTC1+]
GND: C73.1 C75.1 C76.1 C77.1 C78.1 C79.1 C83.1 C84.1 C85.1 C86.1 C87.1 C88.1 C89.1 C93.1 C167.1 C168.1 C169.1 C175.1 C179.1 C180.1 C181.1 C182.1 C183.1 C184.1 C185.1 C211.1 C212.1 C213.1 C214.1 C215.1 C216.1 C226.1 C230.1 C231.1 C236.1 C239.1 C242.1 C243.1 C244.1 C245.1 C246.1 C247.1 C248.1 C249.1 C250.1 C255.1 C256.1 U41.1(VINCOM) U41.8(AVSS) U41.11(VBIAS-) U41.21(DGND) U41.39(REF-) U41.41(EXP) U44.1(VINCOM) U44.8(AVSS) U44.11(VBIAS-) U44.21(DGND) U44.39(REF-) U44.41(EXP) U49.3(VSS) Y1.2(GND) Y1.4(GND) Y2.2(GND) Y2.4(GND)
ADC1_REGCAPA: C215.2 C216.2 U41.7(REGCAPA)
ADC1_REGCAPD: C214.2 C226.2 U41.22(REGCAPD)
ADC1_XTAL1: C181.2 U41.12(XTAL1) Y1.3(OUT/IN)
ADC1_XTAL2: C182.2 U41.13(XTAL2/CLKIO) Y1.1(IN/OUT)
ADC2_nERROR: R300.1 R354.1 ; off-sheet ADC2_nERROR
ADC2_nSYNC: R294.1 ; off-sheet ADC2_nSYNC
ADC2_REGCAPA: C247.2 C248.2 U44.7(REGCAPA)
ADC2_REGCAPD: C246.2 C249.2 U44.22(REGCAPD)
ADC2_SPI_nCS: R290.1 ; off-sheet ADC2_SPI_nCS
ADC2_XTAL1: C185.2 U44.12(XTAL1) Y2.3(OUT/IN)
ADC2_XTAL2: C184.2 U44.13(XTAL2/CLKIO) Y2.1(IN/OUT)
ADC_nERROR: R299.1 R352.1 ; off-sheet ADC_nERROR
ADC_nSYNC: R288.1 ; off-sheet ADC_nSYNC
ADC_SPI_nCS: R281.1 ; off-sheet ADC_SPI_nCS
ADC_TEMP1: C77.2 U41.30(VIN8) ; off-sheet ADC_TEMP1
ADC_TEMP2: C75.2 U41.32(VIN10) ; off-sheet ADC_TEMP2
ADC_TEMP3: C73.2 U41.33(VIN11) ; off-sheet ADC_TEMP3
ADC_TEMP4: C78.2 U41.29(VIN7) ; off-sheet ADC_TEMP4
ADC_TEMP5: C79.2 U41.28(VIN6) ; off-sheet ADC_TEMP5
ADC_TEMP6: C236.2 U41.35(VIN13) ; off-sheet ADC_TEMP6
ADC_TEMP7: C239.2 U41.34(VIN12) ; off-sheet ADC_TEMP7
ADC_TEMP8: C76.2 U41.31(VIN9) ; off-sheet ADC_TEMP8
ADC_TEMP9: C230.2 U41.37(VIN15) ; off-sheet ADC_TEMP9
ADC_TEMP10: C83.2 U41.27(VIN5) ; off-sheet ADC_TEMP10
ADC_TEMP11: C231.2 U41.36(VIN14) ; off-sheet ADC_TEMP11
ADC_TEMP12: C84.2 U41.26(VIN4) ; off-sheet ADC_TEMP12
eFUSE_ILIM_5V_CAM: C179.2 U44.5(VIN3) ; off-sheet eFUSE_ILIM_5V_CAM
eFUSE_ILIM_5V_HD4: C89.2 U44.28(VIN6) ; off-sheet eFUSE_ILIM_5V_HD4
eFUSE_ILIM_5V_IO: C175.2 U44.32(VIN10) ; off-sheet eFUSE_ILIM_5V_IO
eFUSE_ILIM_5V_TEC: C86.2 U44.31(VIN9) ; off-sheet eFUSE_ILIM_5V_TEC
eFUSE_ILIM_12V: C87.2 U44.30(VIN8) ; off-sheet eFUSE_ILIM_12V
eFUSE_ILIM_12V_Heater: C88.2 U44.29(VIN7) ; off-sheet eFUSE_ILIM_12V_Heater
eFUSE_ILIM_12V_Laser: C93.2 U44.27(VIN5) ; off-sheet eFUSE_ILIM_12V_Laser
eFUSE_ILIM_12V_Photo: C180.2 U44.4(VIN2) ; off-sheet eFUSE_ILIM_12V_Photo
eFUSE_ILIM_12V_Solenoid: C85.2 U44.33(VIN11) ; off-sheet eFUSE_ILIM_12V_Solenoid
SOM_ADC_SPI_SCLK: R282.1 R291.1 ; off-sheet SOM_ADC_SPI_SCLK  [project net SOM_TEC_SPI6_SCK]
SOM_ADC_SPI_SDI: R287.1 R293.1 ; off-sheet SOM_ADC_SPI_SDI  [project net SOM_TEC_SPI6_MOSI]
SOM_ADC_SPI_SDO: R286.1 R292.1 ; off-sheet SOM_ADC_SPI_SDO  [project net SOM_TEC_SPI6_MISO]
TEC_ADC_1: C183.2 U41.2(VIN0) ; off-sheet TEC_ADC_1
TEC_ADC_2: C167.2 U41.5(VIN3) ; off-sheet TEC_ADC_2
TEC_ADC_3: C169.2 U41.3(VIN1) ; off-sheet TEC_ADC_3
TEC_ADC_4: C168.2 U41.4(VIN2) ; off-sheet TEC_ADC_4
TEMP _SENSOR: C255.2 R296.2 U44.26(VIN4)
NetC242_2: C242.2 U41.6(REFOUT)
NetC250_2: C250.2 U44.6(REFOUT)
NetR125_1: R125.1 R281.2 U41.17(~{CS})
NetR282_2: R282.2 U41.16(SCLK)
NetR286_2: R286.2 U41.15(DIN)
NetR287_2: R287.2 U41.14(DOUT/~{RDY})
NetR288_2: R288.2 R353.1 U41.19(~{SYNC})
NetR289_1: R289.1 R290.2 U44.17(~{CS})
NetR291_2: R291.2 U44.16(SCLK)
NetR292_2: R292.2 U44.15(DIN)
NetR293_2: R293.2 U44.14(DOUT/~{RDY})
NetR294_2: R294.2 R355.1 U44.19(~{SYNC})
NetR296_1: R296.1 U49.2(VOUT)
NetR299_2: R299.2 U41.18(~{ERROR})
NetR300_2: R300.2 U44.18(~{ERROR})

Not connected (* = marked no-connect by the designer): U41 10(DNC)* 23(GPIO0) 24(GPIO1) 25(GPO2) 38(GPO3); U44 2(VIN0)* 3(VIN1)* 10(DNC)* 23(GPIO0) 24(GPIO1) 25(GPO2) 34(VIN12)* 35(VIN13)* 36(VIN14)* 37(VIN15)* 38(GPO3)

### Notes on the sheet
- Imax =2A => Vmax = 0.6V
- (near R296) -40 => 125*C ~ Vout 0.1 =>1.75V
- Project:
- Sub-system:
- Design by:
- Sheet title:
- Sheet
- of
- Checked by:
- Approved by:
- Revision:
- Document No:
- Size:
- Date:
- A3

### Library data of the parts
C73 C75-C79 C83-C89 C93 C167-C169 C175 C179-C185 C211-C216 C226 C230 C231 C236 C239 C242-C250 C255 C256 = _CAP_C_2: CAP CHIP
R125 R281 R282 R286-R294 R296 R299 R300 R352-R355 = _RES_B_2: RES
U41 U44 = IC_ADC_AD4114BCPZ: Single Supply, Multichannel, 31.25 kSPS, 24-Bit, Sigma-Delta ADC with Â±10 V Inputs; MF: Analog Devices; Value: *; SnapEDA_Link: https://www.snapeda.com/parts/AD4114BCPZ/Analog+Devices/view-part/?ref=snap; MP: AD4114BCPZ; Purchase-URL: https://pricing.snapeda.com/search/part/AD4114BCPZ/?ref=eda; Check_prices: https://www.snapeda.com/parts/AD4114BCPZ/Analog+Devices/view-part/?ref=eda; Availability: In Stock; Price: None; Package: VFQFN-40 Analog Devices
U49 = IC_SENSOR_TC1047AVNBTR: Temperature Sensor Analog, Local -40°C ~ 125°C 10mV/°C SOT-23-3
Y1 Y2 = ECS-240-12-37B-CKY-TR: Package: None; Price: None; Value: *; MP: ECS-240-12-37B-CKY-TR; Availability: Unavailable

## Sheet I2C_Sensor.SchDoc
size 420 x 297 mm; SheetNumber: 20; SheetTotal: 21
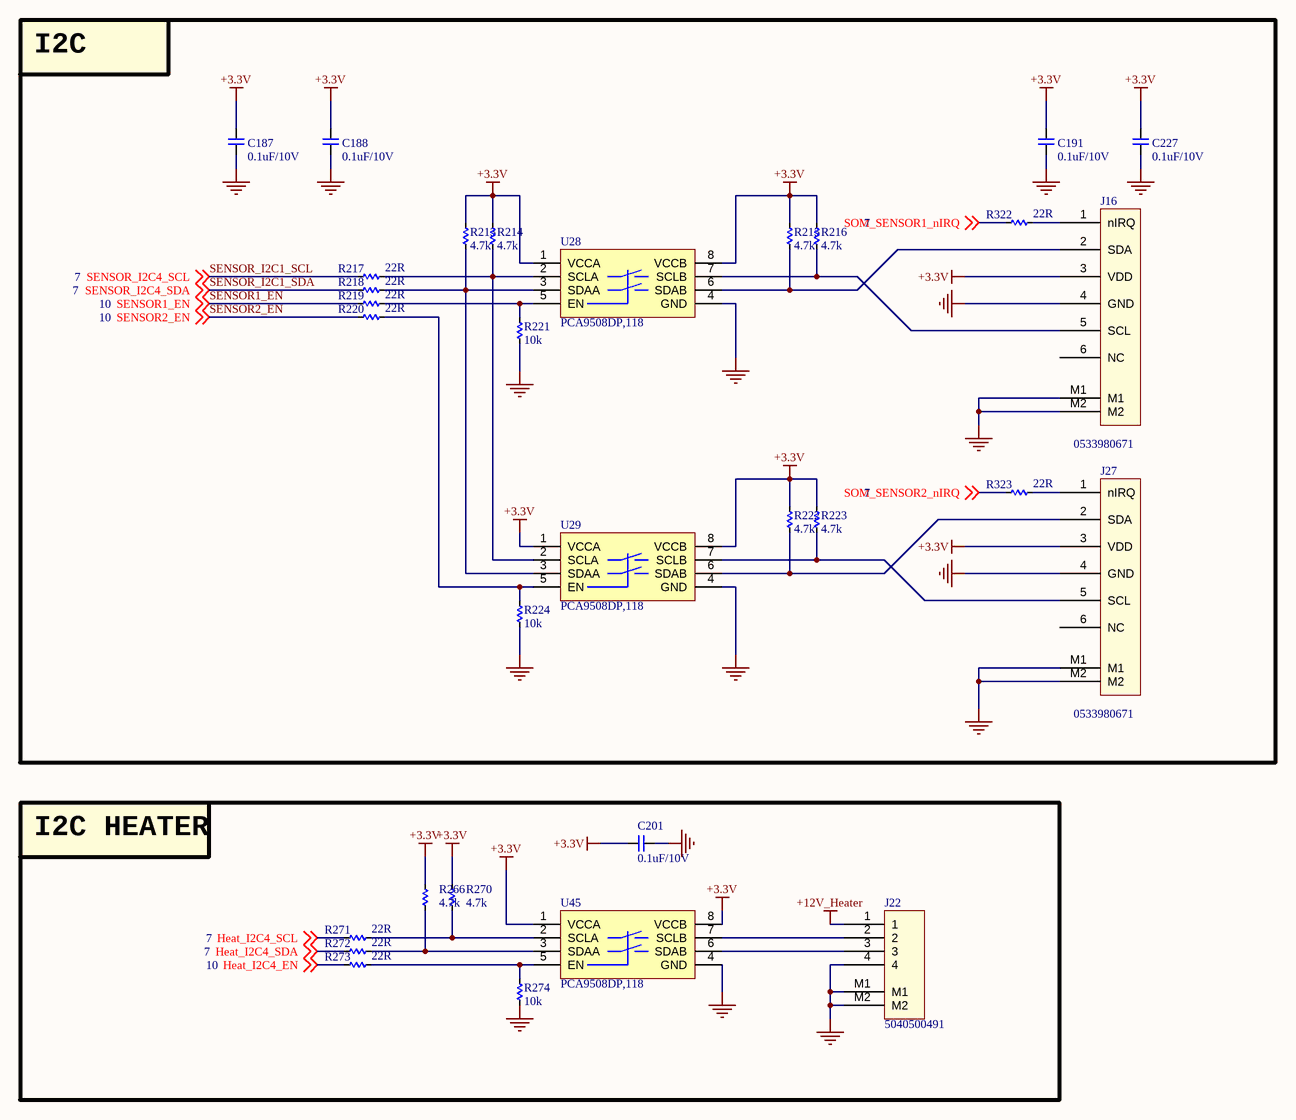
[diagram p18: I2C_Sensor.SchDoc]

### Parts
C187  0.1uF/10V  [CAP_C_1005X60]
C188  0.1uF/10V  [CAP_C_1005X60]
C191  0.1uF/10V  [CAP_C_1005X60]
C201  0.1uF/10V  [CAP_C_1005X60]
C227  0.1uF/10V  [CAP_C_1005X60]
J16  0533980671  [MOLEX_0533980671]
J22  5040500491  [MOLEX_5040500491]
J27  0533980671  [MOLEX_0533980671]
R213  4.7k  [RES_C_1005X40]
R214  4.7k  [RES_C_1005X40]
R215  4.7k  [RES_C_1005X40]
R216  4.7k  [RES_C_1005X40]
R217  22R  [RES_C_1005X40]
R218  22R  [RES_C_1005X40]
R219  22R  [RES_C_1005X40]
R220  22R  [RES_C_1005X40]
R221  10k  [RES_C_1005X40]
R222  4.7k  [RES_C_1005X40]
R223  4.7k  [RES_C_1005X40]
R224  10k  [RES_C_1005X40]
R266  4.7k  [RES_C_1005X40]
R270  4.7k  [RES_C_1005X40]
R271  22R  [RES_C_1005X40]
R272  22R  [RES_C_1005X40]
R273  22R  [RES_C_1005X40]
R274  10k  [RES_C_1005X40]
R322  22R  [RES_C_1005X40]
R323  22R  [RES_C_1005X40]
U28  PCA9508DP,118  [TSOP8]
U29  PCA9508DP,118  [TSOP8]
U45  PCA9508DP,118  [TSOP8]

### Blocks framed on the sheet
I2C: C187 C188 C191 C227 J16 J27 R213-R224 R322 R323 U28 U29
I2C HEATER: C201 J22 R266 R270-R274 U45

### Nets
+3.3V: C187.2 C188.2 C191.2 C201.2 C227.2 J16.3(VDD) J27.3(VDD) R213.1 R214.1 R215.1 R216.1 R222.1 R223.1 R266.1 R270.1 U28.1(VCCA) U28.8(VCCB) U29.1(VCCA) U29.8(VCCB) U45.1(VCCA) U45.8(VCCB)
+12V_Heater: J22.1
GND: C187.1 C188.1 C191.1 C201.1 C227.1 J16.4(GND) J16.M1 J16.M2 J22.4 J22.M1 J22.M2 J27.4(GND) J27.M1 J27.M2 R221.2 R224.2 R274.2 U28.4(GND) U29.4(GND) U45.4(GND)
Heat_I2C4_EN: R273.2 ; off-sheet Heat_I2C4_EN
Heat_I2C4_SCL: R217.2 R271.2 ; off-sheet SENSOR_I2C4_SCL, off-sheet Heat_I2C4_SCL  [also labelled SENSOR_I2C1_SCL, SENSOR_I2C4_SCL]  [project net I2C4_SCL]
Heat_I2C4_SDA: R218.2 R272.2 ; off-sheet SENSOR_I2C4_SDA, off-sheet Heat_I2C4_SDA  [also labelled SENSOR_I2C1_SDA, SENSOR_I2C4_SDA]  [project net I2C4_SDA]
SENSOR1_EN: R219.2 ; off-sheet SENSOR1_EN
SENSOR2_EN: R220.2 ; off-sheet SENSOR2_EN
SOM_SENSOR1_nIRQ: R322.2 ; off-sheet SOM_SENSOR1_nIRQ
SOM_SENSOR2_nIRQ: R323.2 ; off-sheet SOM_SENSOR2_nIRQ
NetJ16_1: J16.1(nIRQ) R322.1
NetJ16_2: J16.2(SDA) R215.2 U28.6(SDAB)
NetJ16_5: J16.5(SCL) R216.2 U28.7(SCLB)
NetJ22_2: J22.2 U45.7(SCLB)
NetJ22_3: J22.3 U45.6(SDAB)
NetJ27_1: J27.1(nIRQ) R323.1
NetJ27_2: J27.2(SDA) R222.2 U29.6(SDAB)
NetJ27_5: J27.5(SCL) R223.2 U29.7(SCLB)
NetR213_2: R213.2 R218.1 U28.3(SDAA) U29.3(SDAA)
NetR214_2: R214.2 R217.1 U28.2(SCLA) U29.2(SCLA)
NetR219_1: R219.1 R221.1 U28.5(EN)
NetR220_1: R220.1 R224.1 U29.5(EN)
NetR266_2: R266.2 R272.1 U45.3(SDAA)
NetR270_2: R270.2 R271.1 U45.2(SCLA)
NetR273_1: R273.1 R274.1 U45.5(EN)

Not connected (* = marked no-connect by the designer): J16 6(NC); J27 6(NC)

### Notes on the sheet
- Project:
- Sub-system:
- Design by:
- Sheet title:
- Sheet
- of
- Checked by:
- Approved by:
- Revision:
- Document No:
- Size:
- Date:
- A3

### Library data of the parts
C187 C188 C191 C201 C227 = _CAP_C_2: CAP CHIP
J16 J27 = FLOW_SENSOR
J22 = Header 4x1_2M
R213-R224 R266 R270-R274 R322 R323 = _RES_B_2: RES

## Sheet MOUTING.SchDoc
size 420 x 297 mm; SheetNumber: 21; SheetTotal: 21
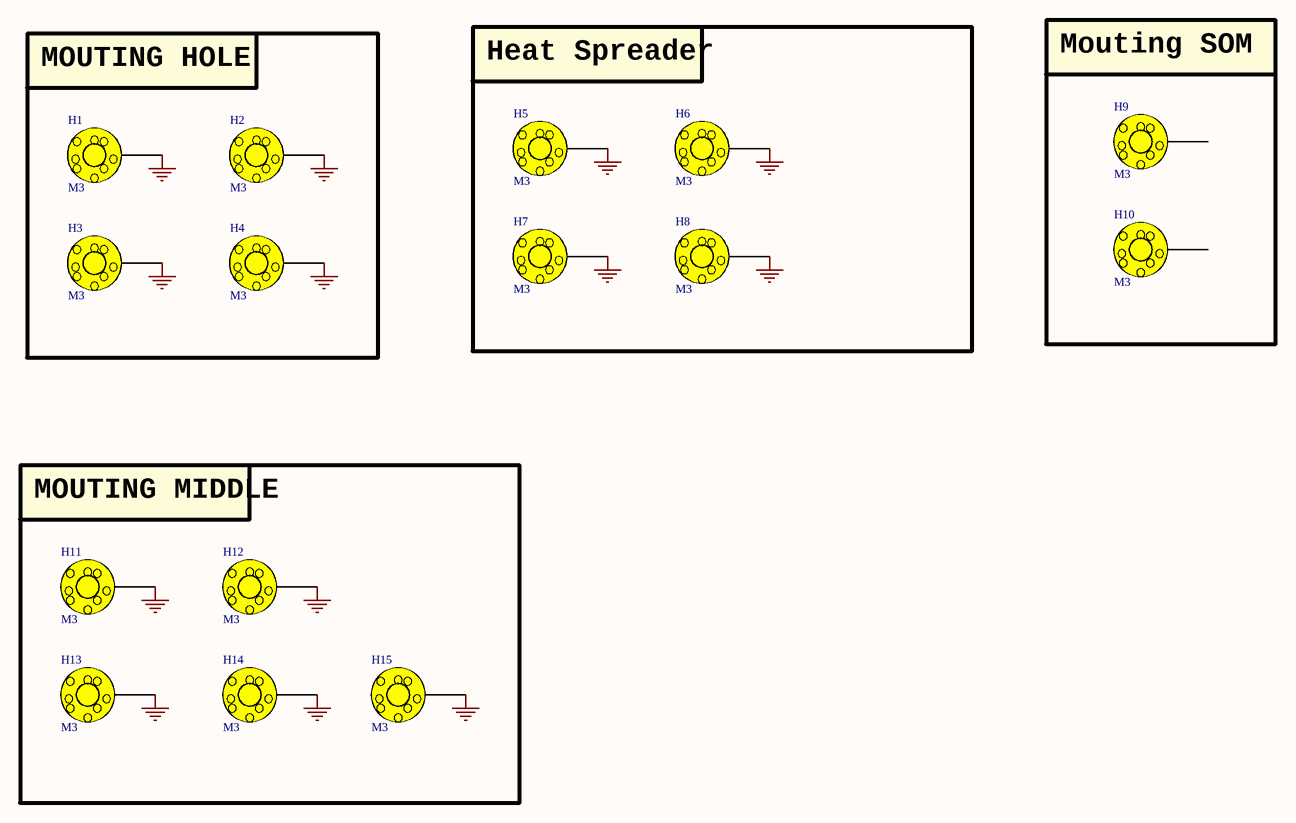
[diagram p19: MOUTING.SchDoc]

### Parts
H1  M3  [HEX-M3_NoVia]
H2  M3  [HEX-M3_NoVia]
H3  M3  [HEX-M3_NoVia]
H4  M3  [HEX-M3_NoVia]
H5  M3  [HEX-M3_NoVia]
H6  M3  [HEX-M3_NoVia]
H7  M3  [HEX-M3_NoVia]
H8  M3  [HEX-M3_NoVia]
H9  M3  [Testpoint_TH_D450H250]
H10  M3  [Testpoint_TH_D450H250]
H11  M3  [HEX-M3_NoVia]
H12  M3  [HEX-M3_NoVia]
H13  M3  [HEX-M3_NoVia]
H14  M3  [HEX-M3_NoVia]
H15  M3  [HEX-M3_NoVia]

### Blocks framed on the sheet
MOUTING HOLE: H1-H4
Heat Spreader: H5-H8
Mouting SOM: H9 H10
MOUTING MIDDLE: H11-H15

### Nets
GND: H1.1 H2.1 H3.1 H4.1 H5.1 H6.1 H7.1 H8.1 H11.1 H12.1 H13.1 H14.1 H15.1

Not connected (* = marked no-connect by the designer): H9 1; H10 1

### Notes on the sheet
- Project:
- Sub-system:
- Design by:
- BAO BUI Q.
- Sheet title:
- Sheet
- A3
- of
- Checked by:
- Approved by:
- VU PHAM
- Revision:
- Document No:
- Size:
- Date:

### Library data of the parts
H1-H15 = HEX-M3